# EAGLE design CyDAQ_schematic (EAGLE 9.0.1)
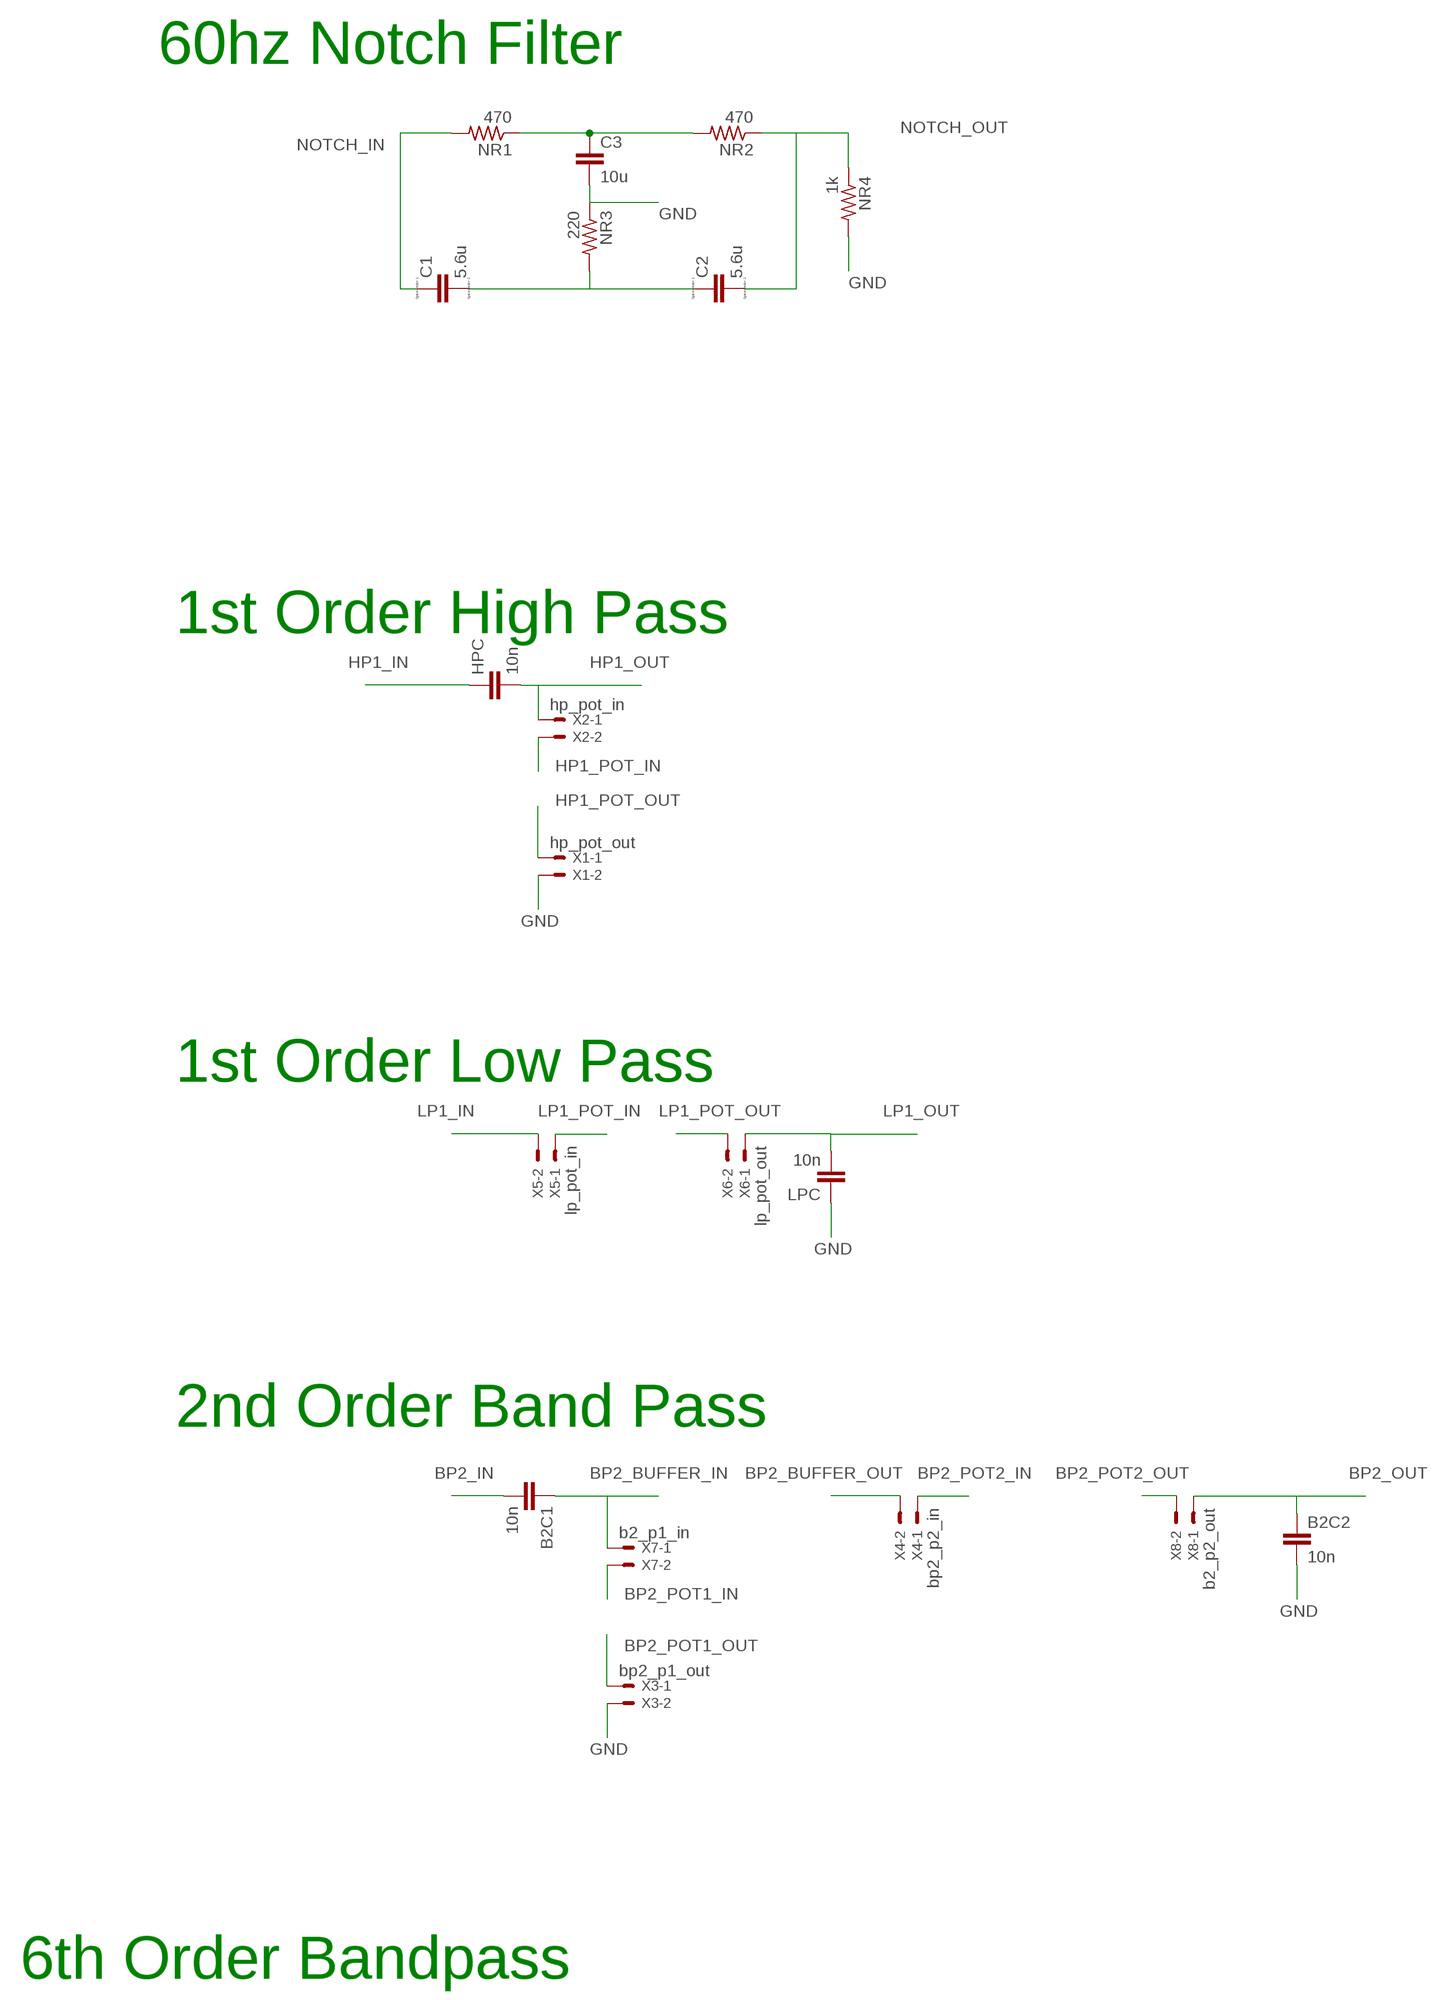
[diagram p0: schematic, sheet 1, part 1 of 3]
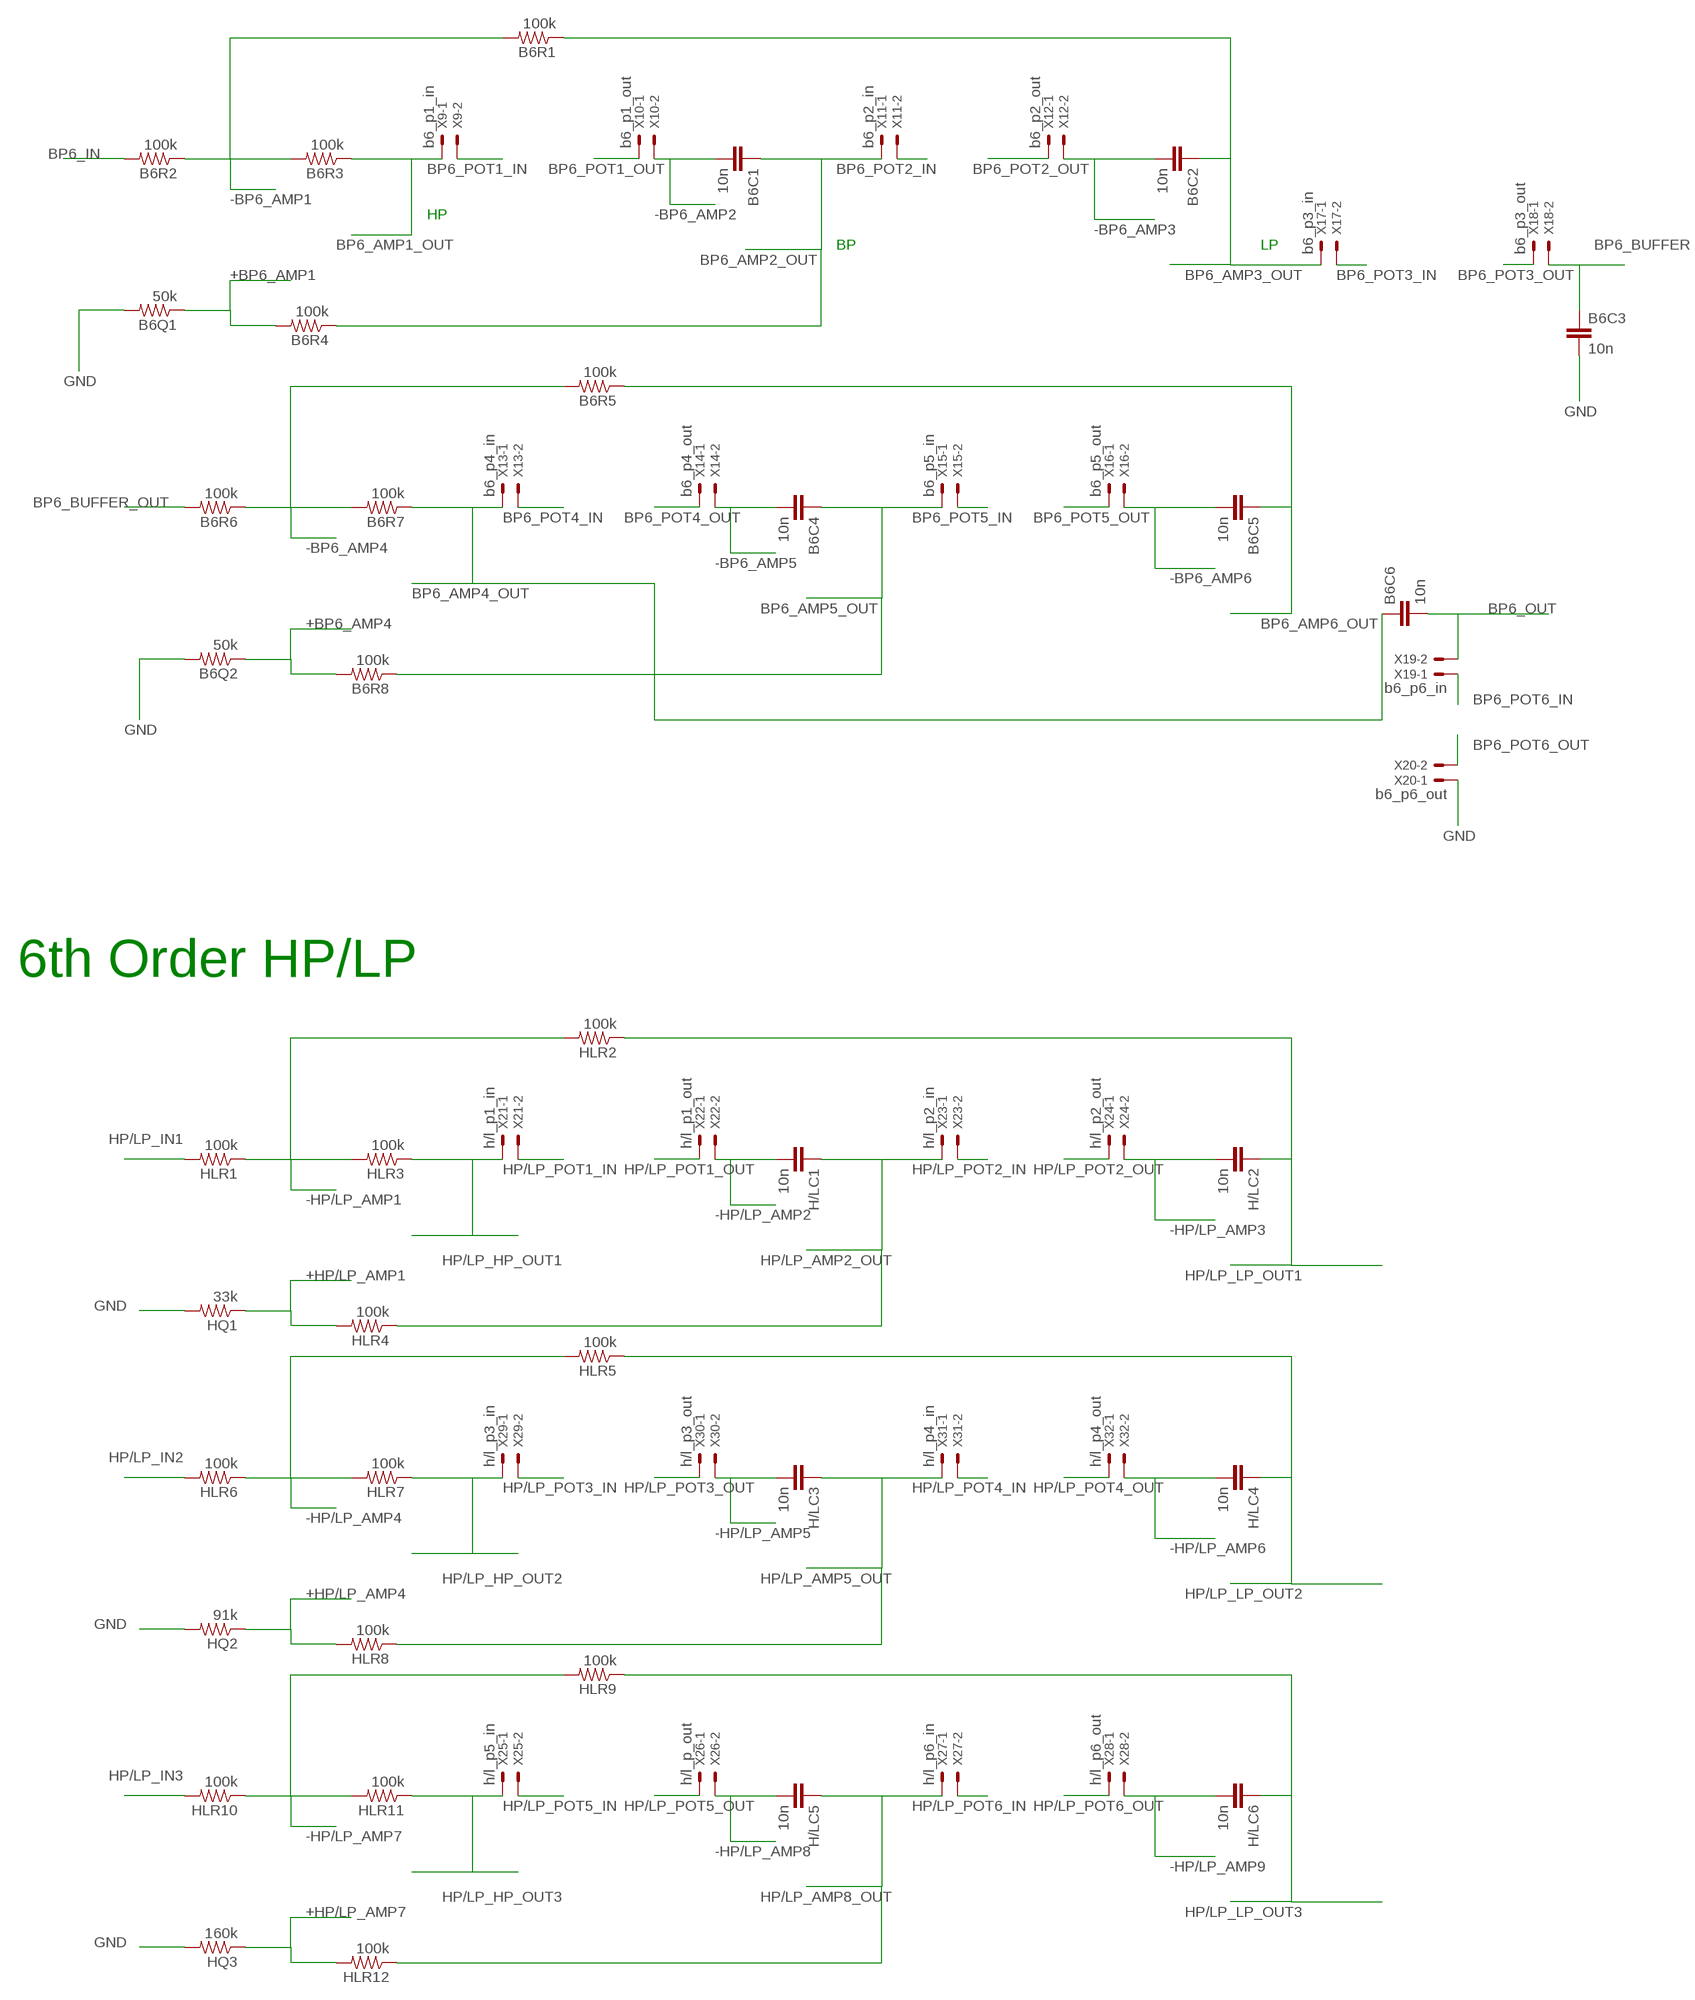
[diagram p1: schematic, sheet 1, part 2 of 3]
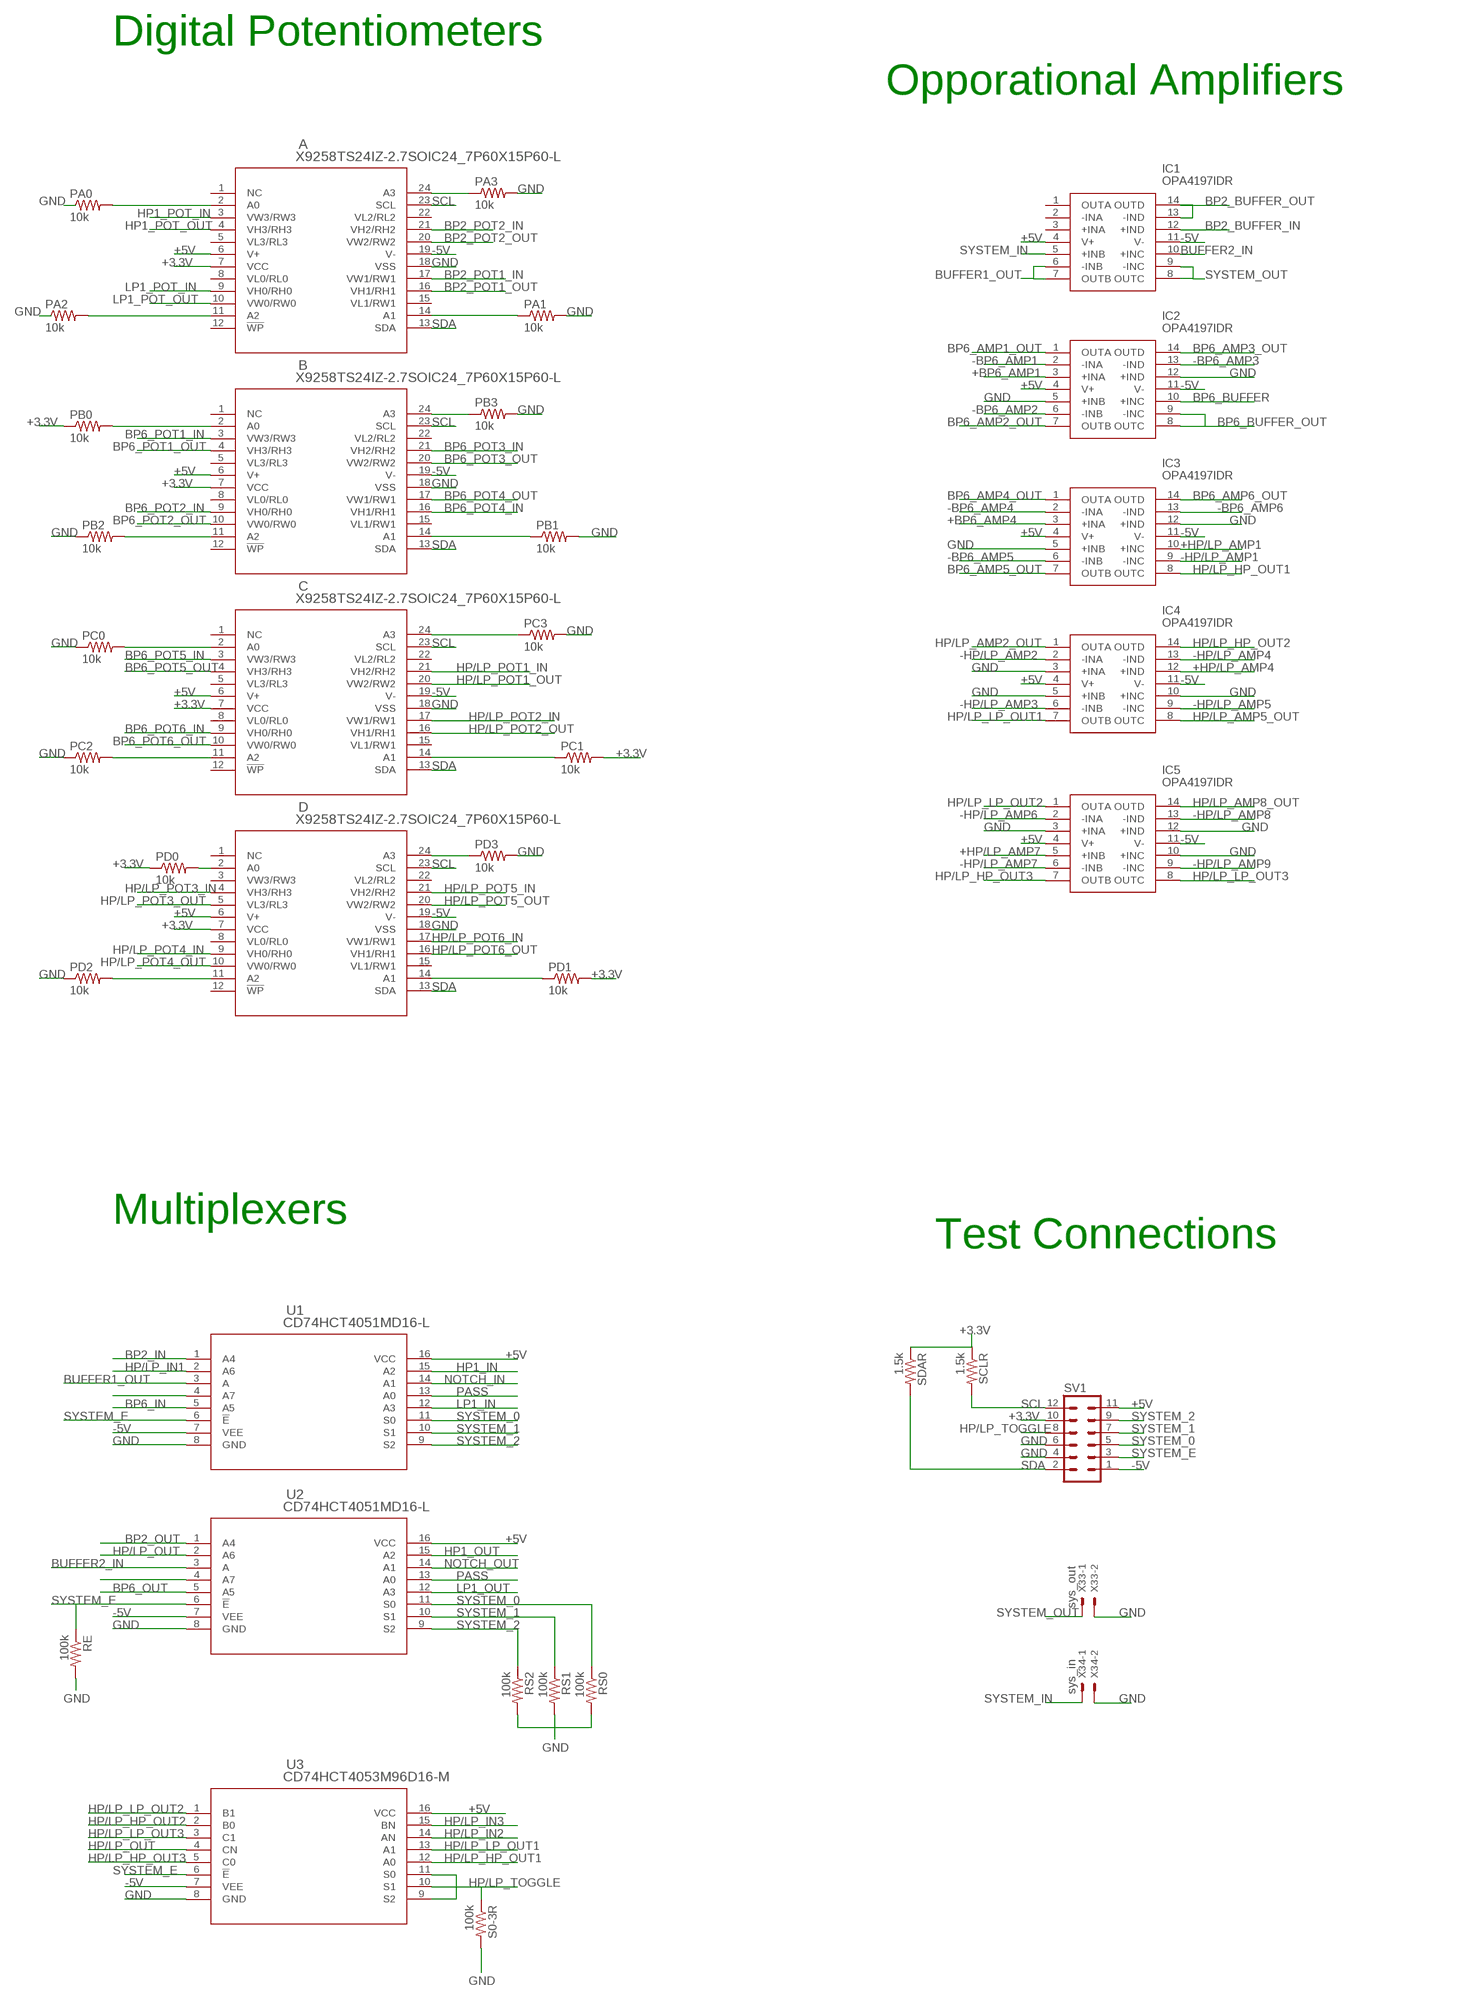
[diagram p2: schematic, sheet 1, part 3 of 3]

## Parts
A  X9258TS24IZ-2.7SOIC24_7P60X15P60-L  [SOIC24_7P60X15P60-L]
B  X9258TS24IZ-2.7SOIC24_7P60X15P60-L  [SOIC24_7P60X15P60-L]
B2C1  10n  C-EUC0805K  [C0805K]
B2C2  10n  C-EUC0805K  [C0805K]
B6C1  10n  C-EUC0805K  [C0805K]
B6C2  10n  C-EUC0805K  [C0805K]
B6C3  10n  C-EUC0805K  [C0805K]
B6C4  10n  C-EUC0805K  [C0805K]
B6C5  10n  C-EUC0805K  [C0805K]
B6C6  10n  C-EUC0805K  [C0805K]
B6Q1  50k  R-US_R0805W  [R0805W]
B6Q2  50k  R-US_R0805W  [R0805W]
B6R1  100k  R-US_R0805W  [R0805W]
B6R2  100k  R-US_R0805W  [R0805W]
B6R3  100k  R-US_R0805W  [R0805W]
B6R4  100k  R-US_R0805W  [R0805W]
B6R5  100k  R-US_R0805W  [R0805W]
B6R6  100k  R-US_R0805W  [R0805W]
B6R7  100k  R-US_R0805W  [R0805W]
B6R8  100k  R-US_R0805W  [R0805W]
C  X9258TS24IZ-2.7SOIC24_7P60X15P60-L  [SOIC24_7P60X15P60-L]
C1  5.6u  CC1206  [C1206]
C2  5.6u  CC1206  [C1206]
C3  10u  C-EUC2012  [C2012]
D  X9258TS24IZ-2.7SOIC24_7P60X15P60-L  [SOIC24_7P60X15P60-L]
H/LC1  10n  C-EUC0805K  [C0805K]
H/LC2  10n  C-EUC0805K  [C0805K]
H/LC3  10n  C-EUC0805K  [C0805K]
H/LC4  10n  C-EUC0805K  [C0805K]
H/LC5  10n  C-EUC0805K  [C0805K]
H/LC6  10n  C-EUC0805K  [C0805K]
HLR1  100k  R-US_R0805W  [R0805W]
HLR2  100k  R-US_R0805W  [R0805W]
HLR3  100k  R-US_R0805W  [R0805W]
HLR4  100k  R-US_R0805W  [R0805W]
HLR5  100k  R-US_R0805W  [R0805W]
HLR6  100k  R-US_R0805W  [R0805W]
HLR7  100k  R-US_R0805W  [R0805W]
HLR8  100k  R-US_R0805W  [R0805W]
HLR9  100k  R-US_R0805W  [R0805W]
HLR10  100k  R-US_R0805W  [R0805W]
HLR11  100k  R-US_R0805W  [R0805W]
HLR12  100k  R-US_R0805W  [R0805W]
HPC  10n  C-EUC0805K  [C0805K]
HQ1  33k  R-US_R0805W  [R0805W]
HQ2  91k  R-US_R0805W  [R0805W]
HQ3  160k  R-US_R0805W  [R0805W]
IC1  OPA4197IDR  [SOIC127P600X175-14N]
IC2  OPA4197IDR  [SOIC127P600X175-14N]
IC3  OPA4197IDR  [SOIC127P600X175-14N]
IC4  OPA4197IDR  [SOIC127P600X175-14N]
IC5  OPA4197IDR  [SOIC127P600X175-14N]
LPC  10n  C-EUC0805K  [C0805K]
NR1  470  R-US_R0805W  [R0805W]
NR2  470  R-US_R0805W  [R0805W]
NR3  220  R-US_R0805W  [R0805W]
NR4  1k  R-US_R0805W  [R0805W]
PA0  10k  R-US_R0805W  [R0805W]
PA1  10k  R-US_R0805W  [R0805W]
PA2  10k  R-US_R0805W  [R0805W]
PA3  10k  R-US_R0805W  [R0805W]
PB0  10k  R-US_R0805W  [R0805W]
PB1  10k  R-US_R0805W  [R0805W]
PB2  10k  R-US_R0805W  [R0805W]
PB3  10k  R-US_R0805W  [R0805W]
PC0  10k  R-US_R0805W  [R0805W]
PC1  10k  R-US_R0805W  [R0805W]
PC2  10k  R-US_R0805W  [R0805W]
PC3  10k  R-US_R0805W  [R0805W]
PD0  10k  R-US_R0805W  [R0805W]
PD1  10k  R-US_R0805W  [R0805W]
PD2  10k  R-US_R0805W  [R0805W]
PD3  10k  R-US_R0805W  [R0805W]
RE  100k  R-US_R0805W  [R0805W]
RS0  100k  R-US_R0805W  [R0805W]
RS1  100k  R-US_R0805W  [R0805W]
RS2  100k  R-US_R0805W  [R0805W]
S0-3R  100k  R-US_R0805W  [R0805W]
SCLR  1.5k  R-US_R0805W  [R0805W]
SDAR  1.5k  R-US_R0805W  [R0805W]
SV1  MA06-2  [MA06-2]
U1  CD74HCT4051MD16-L  [D16-L]
U2  CD74HCT4051MD16-L  [D16-L]
U3  CD74HCT4053M96D16-M  [D16-M]
X1  hp_pot_out  22-23-2021  [22-23-2021]
X2  hp_pot_in  22-23-2021  [22-23-2021]
X3  bp2_p1_out  22-23-2021  [22-23-2021]
X4  bp2_p2_in  22-23-2021  [22-23-2021]
X5  lp_pot_in  22-23-2021  [22-23-2021]
X6  lp_pot_out  22-23-2021  [22-23-2021]
X7  b2_p1_in  22-23-2021  [22-23-2021]
X8  b2_p2_out  22-23-2021  [22-23-2021]
X9  b6_p1_in  22-23-2021  [22-23-2021]
X10  b6_p1_out  22-23-2021  [22-23-2021]
X11  b6_p2_in  22-23-2021  [22-23-2021]
X12  b6_p2_out  22-23-2021  [22-23-2021]
X13  b6_p4_in  22-23-2021  [22-23-2021]
X14  b6_p4_out  22-23-2021  [22-23-2021]
X15  b6_p5_in  22-23-2021  [22-23-2021]
X16  b6_p5_out  22-23-2021  [22-23-2021]
X17  b6_p3_in  22-23-2021  [22-23-2021]
X18  b6_p3_out  22-23-2021  [22-23-2021]
X19  b6_p6_in  22-23-2021  [22-23-2021]
X20  b6_p6_out  22-23-2021  [22-23-2021]
X21  h/l_p1_in  22-23-2021  [22-23-2021]
X22  h/l_p1_out  22-23-2021  [22-23-2021]
X23  h/l_p2_in  22-23-2021  [22-23-2021]
X24  h/l_p2_out  22-23-2021  [22-23-2021]
X25  h/l_p5_in  22-23-2021  [22-23-2021]
X26  h/l_p_out  22-23-2021  [22-23-2021]
X27  h/l_p6_in  22-23-2021  [22-23-2021]
X28  h/l_p6_out  22-23-2021  [22-23-2021]
X29  h/l_p3_in  22-23-2021  [22-23-2021]
X30  h/l_p3_out  22-23-2021  [22-23-2021]
X31  h/l_p4_in  22-23-2021  [22-23-2021]
X32  h/l_p4_out  22-23-2021  [22-23-2021]
X33  sys_out  22-23-2021  [22-23-2021]
X34  sys_in  22-23-2021  [22-23-2021]

## Nets
+3.3V: A.7(VCC) B.7(VCC) C.7(VCC) D.7(VCC) PB0.1 PC1.2 PD0.1 PD1.2 SCLR.1 SDAR.1 SV1.10
+5V: A.6(V+) B.6(V+) C.6(V+) D.6(V+) IC1.4(V+) IC2.4(V+) IC3.4(V+) IC4.4(V+) IC5.4(V+) SV1.11 U1.16(VCC) U2.16(VCC) U3.16(VCC)
+BP6_AMP1: B6Q1.1 B6R4.2 IC2.3(+INA)
+BP6_AMP4: B6Q2.1 B6R8.2 IC3.3(+INA)
+HP/LP_AMP1: HLR4.2 HQ1.1 IC3.10(+INC)
+HP/LP_AMP4: HLR8.2 HQ2.1 IC4.12(+IND)
+HP/LP_AMP7: HLR12.2 HQ3.1 IC5.5(+INB)
-5V: A.19(V-) B.19(V-) C.19(V-) D.19(V-) IC1.11(V-) IC2.11(V-) IC3.11(V-) IC4.11(V-) IC5.11(V-) SV1.1 U1.7(VEE) U2.7(VEE) U3.7(VEE)
-BP6_AMP1: B6R1.2 B6R2.1 B6R3.2 IC2.2(-INA)
-BP6_AMP2: B6C1.2 IC2.6(-INB) X10.2
-BP6_AMP3: B6C2.2 IC2.13(-IND) X12.2
-BP6_AMP4: B6R5.2 B6R6.1 B6R7.2 IC3.2(-INA)
-BP6_AMP5: B6C4.2 IC3.6(-INB) X14.2
-BP6_AMP6: B6C5.2 IC3.13(-IND) X16.2
-HP/LP_AMP1: HLR1.1 HLR2.2 HLR3.2 IC3.9(-INC)
-HP/LP_AMP2: H/LC1.2 IC4.2(-INA) X22.2
-HP/LP_AMP3: H/LC2.2 IC4.6(-INB) X24.2
-HP/LP_AMP4: HLR5.2 HLR6.1 HLR7.2 IC4.13(-IND)
-HP/LP_AMP5: H/LC3.2 IC4.9(-INC) X30.2
-HP/LP_AMP6: H/LC4.2 IC5.2(-INA) X32.2
-HP/LP_AMP7: HLR9.2 HLR10.1 HLR11.2 IC5.6(-INB)
-HP/LP_AMP8: H/LC5.2 IC5.13(-IND) X26.2
-HP/LP_AMP9: H/LC6.2 IC5.9(-INC) X28.2
BP2_BUFFER_IN: B2C1.1 IC1.12(+IND) X7.1
BP2_BUFFER_OUT: IC1.13(-IND) IC1.14(OUTD) X4.2
BP2_IN: B2C1.2 U1.1(A4)
BP2_OUT: B2C2.1 U2.1(A4) X8.1
BP2_POT1_IN: A.17(VW1/RW1) X7.2
BP2_POT1_OUT: A.16(VH1/RH1) X3.1
BP2_POT2_IN: A.21(VH2/RH2) X4.1
BP2_POT2_OUT: A.20(VW2/RW2) X8.2
BP6_AMP1_OUT: B6R3.1 IC2.1(OUTA) X9.1
BP6_AMP2_OUT: B6C1.1 B6R4.1 IC2.7(OUTB) X11.1
BP6_AMP3_OUT: B6C2.1 B6R1.1 IC2.14(OUTD) X17.1
BP6_AMP4_OUT: B6C6.1 B6R7.1 IC3.1(OUTA) X13.1
BP6_AMP5_OUT: B6C4.1 B6R8.1 IC3.7(OUTB) X15.1
BP6_AMP6_OUT: B6C5.1 B6R5.1 IC3.14(OUTD)
BP6_BUFFER: B6C3.1 IC2.10(+INC) X18.2
BP6_BUFFER_OUT: B6R6.2 IC2.8(OUTC) IC2.9(-INC)
BP6_IN: B6R2.2 U1.5(A5)
BP6_OUT: B6C6.2 U2.5(A5) X19.2
BP6_POT1_IN: B.3(VW3/RW3) X9.2
BP6_POT1_OUT: B.4(VH3/RH3) X10.1
BP6_POT2_IN: B.9(VH0/RH0) X11.2
BP6_POT2_OUT: B.10(VW0/RW0) X12.1
BP6_POT3_IN: B.21(VH2/RH2) X17.2
BP6_POT3_OUT: B.20(VW2/RW2) X18.1
BP6_POT4_IN: B.16(VH1/RH1) X13.2
BP6_POT4_OUT: B.17(VW1/RW1) X14.1
BP6_POT5_IN: C.3(VW3/RW3) X15.2
BP6_POT5_OUT: C.4(VH3/RH3) X16.1
BP6_POT6_IN: C.9(VH0/RH0) X19.1
BP6_POT6_OUT: C.10(VW0/RW0) X20.2
BUFFER1_OUT: IC1.6(-INB) IC1.7(OUTB) U1.3(A)
BUFFER2_IN: IC1.10(+INC) U2.3(A)
GND: A.18(VSS) B2C2.2 B6C3.2 B6Q1.2 B6Q2.2 B.18(VSS) C3.2 C.18(VSS) D.18(VSS) HQ1.2 HQ2.2 HQ3.2 IC2.5(+INB) IC2.12(+IND) IC3.5(+INB) IC3.12(+IND) IC4.3(+INA) IC4.5(+INB) IC4.10(+INC) IC5.3(+INA) IC5.10(+INC) IC5.12(+IND) LPC.1 NR3.1 NR4.2 PA0.1 PA1.2 PA2.1 PA3.2 PB1.2 PB2.1 PB3.2 PC0.1 PC2.1 PC3.2 PD2.1 PD3.2 RE.2 RS0.2 RS1.2 RS2.2 S0-3R.2 SV1.4 SV1.6 U1.8(GND) U2.8(GND) U3.8(GND) X1.2 X3.2 X20.1 X33.2 X34.2
HP1_IN: HPC.1 U1.15(A2)
HP1_OUT: HPC.2 U2.15(A2) X2.1
HP1_POT_IN: A.3(VW3/RW3) X2.2
HP1_POT_OUT: A.4(VH3/RH3) X1.1
HP/LP_AMP2_OUT: H/LC1.1 HLR4.1 IC4.1(OUTA) X23.1
HP/LP_AMP5_OUT: H/LC3.1 HLR8.1 IC4.8(OUTC) X31.1
HP/LP_AMP8_OUT: H/LC5.1 HLR12.1 IC5.14(OUTD) X27.1
HP/LP_HP_OUT1: HLR3.1 IC3.8(OUTC) U3.12(A0) X21.1
HP/LP_HP_OUT2: HLR7.1 IC4.14(OUTD) U3.2(B0) X29.1
HP/LP_HP_OUT3: HLR11.1 IC5.7(OUTB) U3.5(C0) X25.1
HP/LP_IN1: HLR1.2 U1.2(A6)
HP/LP_IN2: HLR6.2 U3.14(AN)
HP/LP_IN3: HLR10.2 U3.15(BN)
HP/LP_LP_OUT1: H/LC2.1 HLR2.1 IC4.7(OUTB) U3.13(A1)
HP/LP_LP_OUT2: H/LC4.1 HLR5.1 IC5.1(OUTA) U3.1(B1)
HP/LP_LP_OUT3: H/LC6.1 HLR9.1 IC5.8(OUTC) U3.3(C1)
HP/LP_OUT: U2.2(A6) U3.4(CN)
HP/LP_POT1_IN: C.21(VH2/RH2) X21.2
HP/LP_POT1_OUT: C.20(VW2/RW2) X22.1
HP/LP_POT2_IN: C.17(VW1/RW1) X23.2
HP/LP_POT2_OUT: C.16(VH1/RH1) X24.1
HP/LP_POT3_IN: D.4(VH3/RH3) X29.2
HP/LP_POT3_OUT: D.5(VL3/RL3) X30.1
HP/LP_POT4_IN: D.9(VH0/RH0) X31.2
HP/LP_POT4_OUT: D.10(VW0/RW0) X32.1
HP/LP_POT5_IN: D.21(VH2/RH2) X25.2
HP/LP_POT5_OUT: D.20(VW2/RW2) X26.1
HP/LP_POT6_IN: D.17(VW1/RW1) X27.2
HP/LP_POT6_OUT: D.16(VH1/RH1) X28.1
HP/LP_TOGGLE: S0-3R.1 SV1.8 U3.9(S2) U3.10(S1) U3.11(S0)
LP1_IN: U1.12(A3) X5.2
LP1_OUT: LPC.2 U2.12(A3) X6.1
LP1_POT_IN: A.9(VH0/RH0) X5.1
LP1_POT_OUT: A.10(VW0/RW0) X6.2
N$1: A.2(A0) PA0.2
N$2: A.11(A2) PA2.2
N$3: A.14(A1) PA1.1
N$4: A.24(A3) PA3.1
N$5: B.2(A0) PB0.2
N$6: B.11(A2) PB2.2
N$7: B.14(A1) PB1.1
N$8: B.24(A3) PB3.1
N$9: C1.2 C2.1 NR3.2
N$10: C.2(A0) PC0.2
N$11: C.11(A2) PC2.2
N$12: C.14(A1) PC1.1
N$13: C.24(A3) PC3.1
N$14: D.2(A0) PD0.2
N$15: D.11(A2) PD2.2
N$16: D.14(A1) PD1.1
N$17: D.24(A3) PD3.1
N$19: C3.1 NR1.1 NR2.2
N$26: U2.4(A7)
N$36: U1.4(A7)
NOTCH_IN: C1.1 NR1.2 U1.14(A1)
NOTCH_OUT: C2.2 NR2.1 NR4.1 U2.14(A1)
PASS: U1.13(A0) U2.13(A0)
SCL: A.23(SCL) B.23(SCL) C.23(SCL) D.23(SCL) SCLR.2 SV1.12
SDA: A.13(SDA) B.13(SDA) C.13(SDA) D.13(SDA) SDAR.2 SV1.2
SYSTEM_0: RS0.1 SV1.5 U1.11(S0) U2.11(S0)
SYSTEM_1: RS1.1 SV1.7 U1.10(S1) U2.10(S1)
SYSTEM_2: RS2.1 SV1.9 U1.9(S2) U2.9(S2)
SYSTEM_E: RE.1 SV1.3 U1.6(!E) U2.6(!E) U3.6(!E)
SYSTEM_IN: IC1.5(+INB) X34.1
SYSTEM_OUT: IC1.8(OUTC) IC1.9(-INC) X33.1
Unconnected: A.1(NC) A.5(VL3/RL3) A.8(VL0/RL0) A.12(!WP) A.15(VL1/RW1) A.22(VL2/RL2) B.1(NC) B.5(VL3/RL3) B.8(VL0/RL0) B.12(!WP) B.15(VL1/RW1) B.22(VL2/RL2) C.1(NC) C.5(VL3/RL3) C.8(VL0/RL0) C.12(!WP) C.15(VL1/RW1) C.22(VL2/RL2) D.1(NC) D.3(VW3/RW3) D.8(VL0/RL0) D.12(!WP) D.15(VL1/RW1) D.22(VL2/RL2) IC1.1(OUTA) IC1.2(-INA) IC1.3(+INA)

## Notes on the sheet
- 60hz Notch Filter
- 1st Order High Pass
- Digital Potentiometers
- Opporational Amplifiers
- 1st Order Low Pass
- 2nd Order Band Pass
- 6th Order Bandpass
- HP
- BP | LP
- Multiplexers
- Test Connections
- 6th Order HP/LP

## Library data of the parts
A B C D = potWithPosNeg5:X9258TS24IZ-2.7; MANUFACTURER_PART_NUMBER: X9258TS24IZ2.7; VENDOR: Intersil
B2C1 B2C2 B6C1-B6C6 C3 H/LC1-H/LC6 HPC LPC = resistor:C-EU: CAPACITOR, European symbol
B6Q1 B6Q2 B6R1-B6R8 HLR1-HLR12 HQ1-HQ3 NR1-NR4 PA0 PA1-PA3 PB0 PB1-PB3 PC0 PC1-PC3 PD0 PD1-PD3 RE RS0 RS1 RS2 S0-3R SCLR SDAR = resistor:R-US_: RESISTOR, American symbol
C1 C2 = eagle-ltspice:C: CAPACITOR, European symbol; SPICEMODEL: NONE; SPICEPREFIX: C
IC1-IC5 = opAmp:OPA4197IDR: 36-V, Precision, Rail-to-Rail Input Output, Low Offset Voltage Op Amp Source: Datasheet <http://www.ti.com/lit/gpn/opa4197>; DESCRIPTION: 36-V, Precision, Rail-to-Rail Input Output, Low Offset Voltage Op Amp; HEIGHT: 1.75mm; MANUFACTURER_NAME: Texas Instruments; MANUFACTURER_PART_NUMBER: OPA4197IDR; MOUSER_PART_NUMBER: 595-OPA4197IDR
SV1 = con-lstb:MA06-2: PIN HEADER; OC_FARNELL: unknown; OC_NEWARK: unknown
U1 U2 = 8 to one mux:CD74HCT4051M; MANUFACTURER_PART_NUMBER: CD74HCT4051M; VENDOR: Texas Instruments
U3 = 3, 2 to 1 muxes:CD74HCT4053M96; MANUFACTURER_PART_NUMBER: CD74HCT4053M96; VENDOR: Texas Instruments
X1-X34 = con-molex:22-23-2021: .100" (2.54mm) Center Header - 2 Pin; MF: MOLEX; MPN: 22-23-2021; OC_FARNELL: 1462926; OC_NEWARK: 25C3832

## Board
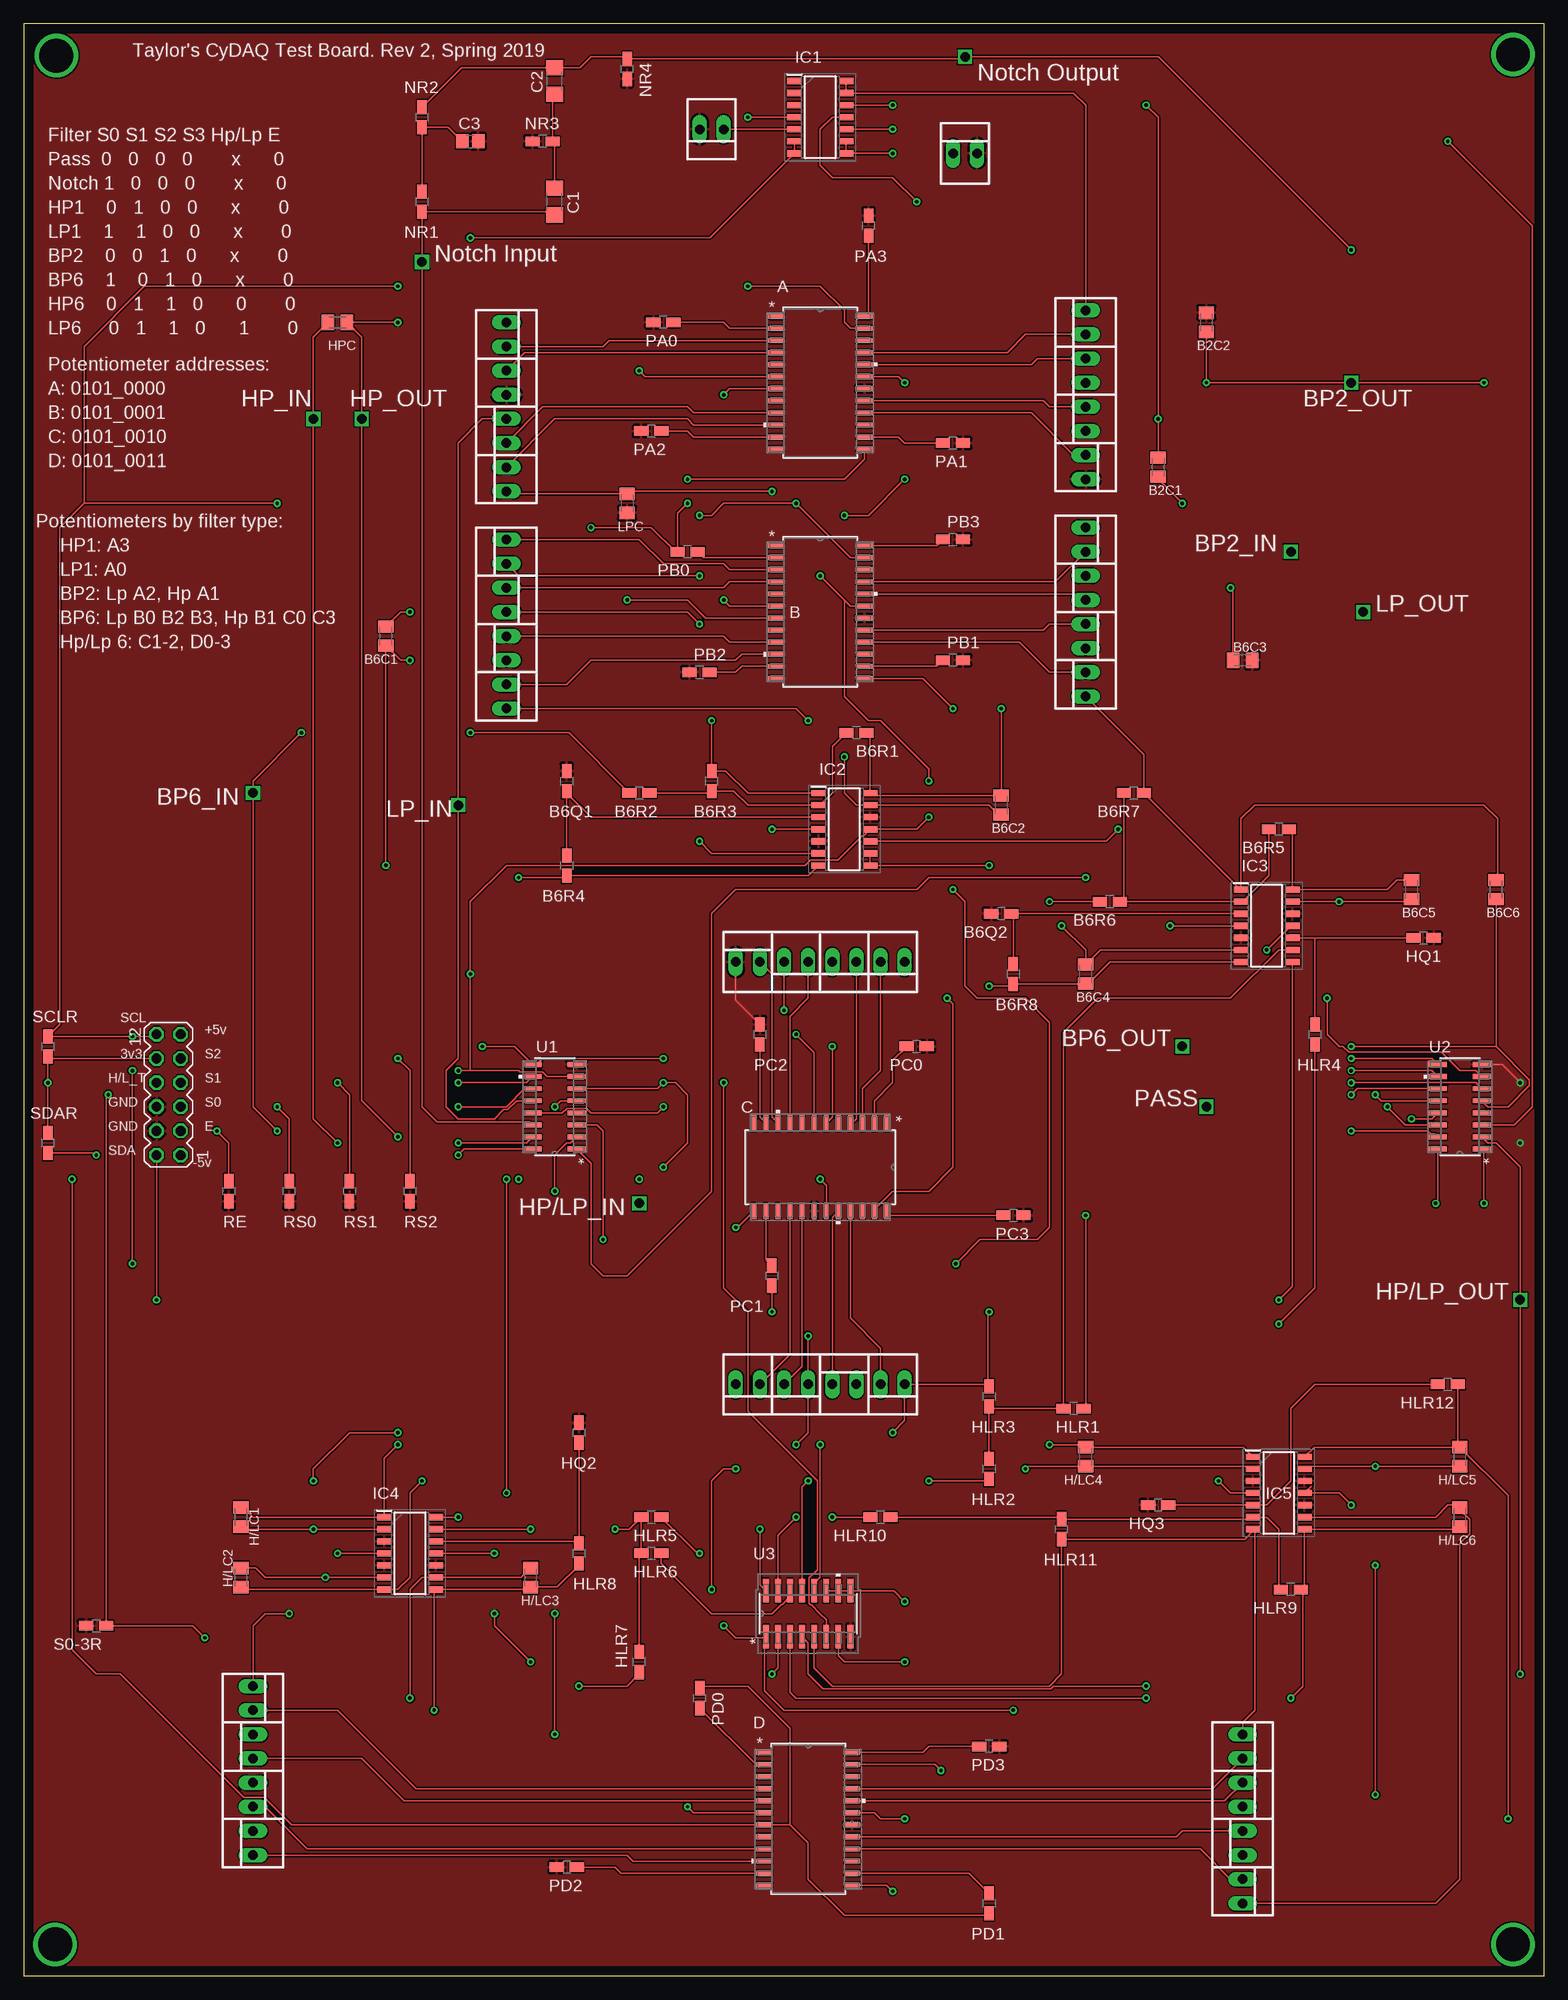
[diagram p3: board, top side]
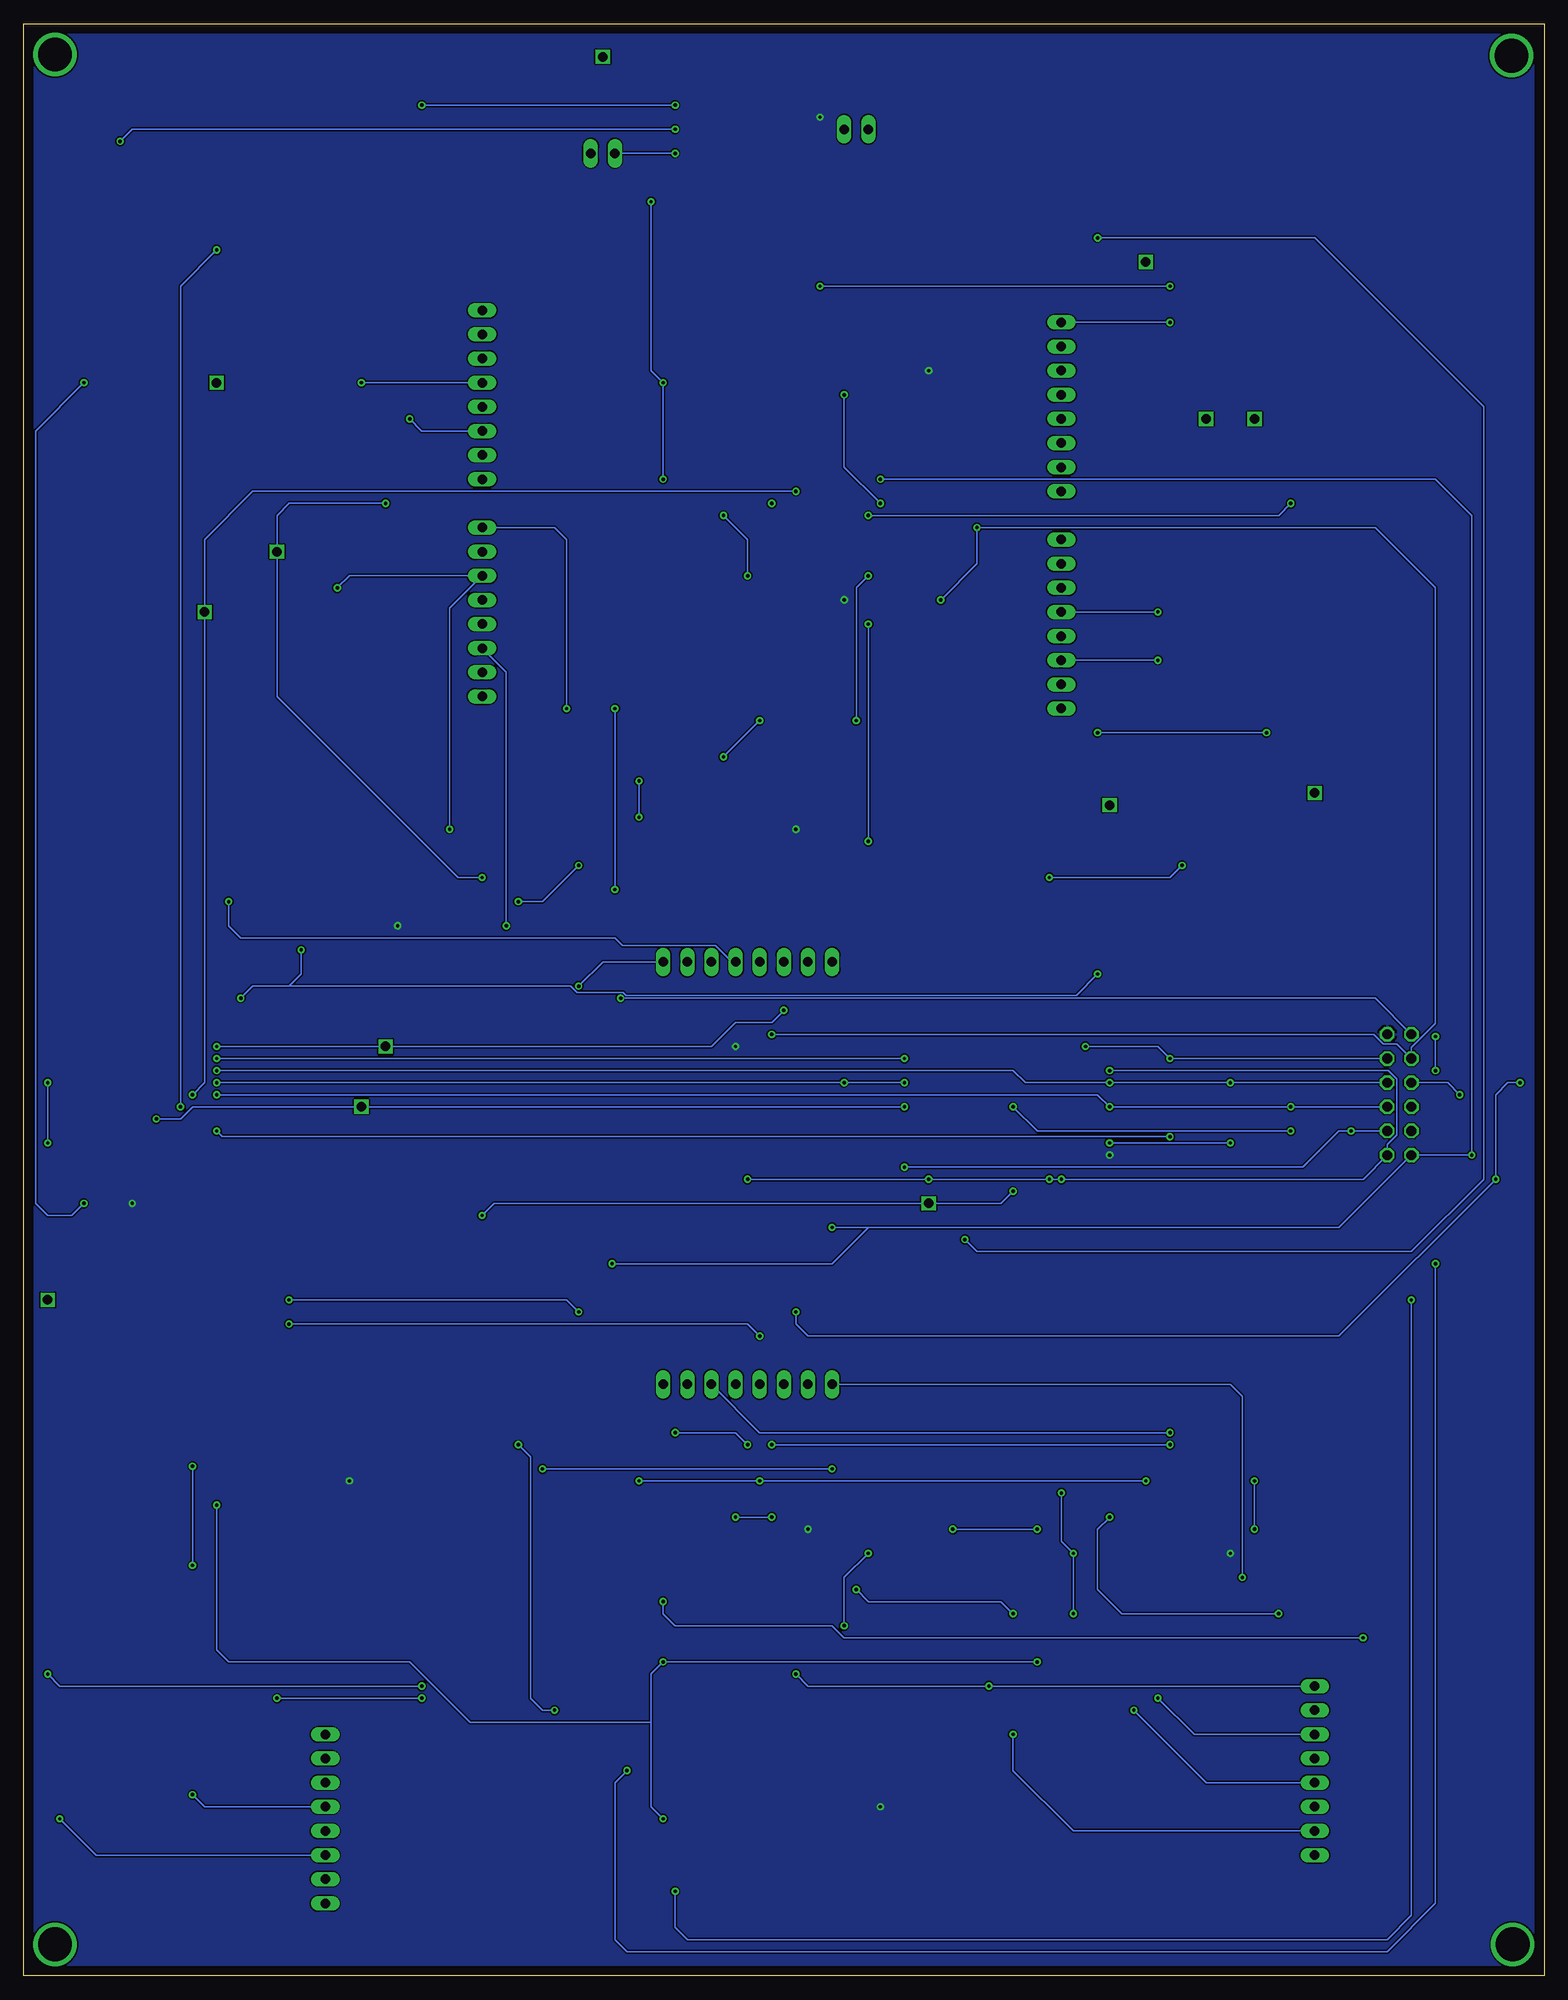
[diagram p4: board, bottom side, seen from below]

Size 160 x 205.41 mm. Coordinates in mm from the lower left corner, seen from the top.
Outline: 0,0 160,0 160,205.41 0,205.41 0,0
Copper layers (1*16): Top 0.035mm / dielectric 1.5mm / Bottom 0.035mm
Design rules "default": minimum track width 6mil, minimum drill 0.35mm, track to track 6mil, track to pad 6mil, pad to pad 6mil, via to via 6mil, smd to smd 6mil, copper to edge 40mil, drill to drill 6mil, minimum pad ring 10mil, minimum via ring 8mil, stop-mask expansion 4mil, vias tented up to drill 0mil, thermal gap 10mil

### Footprints (pad centres in the part's own frame; a part is rotated, then mirrored left to right if it is on the bottom)
SOIC24_7P60X15P60-L = smd 1.676 x 0.508: 1 -4.636,6.985; 2 -4.636,5.715; 3 -4.636,4.445; 4 -4.636,3.175; 5 -4.636,1.905; 6 -4.636,0.635; 7 -4.636,-0.635; 8 -4.636,-1.905; 9 -4.636,-3.175; 10 -4.636,-4.445; 11 -4.636,-5.715; 12 -4.636,-6.985; 13 4.636,-6.985; 14 4.636,-5.715; 15 4.636,-4.445; 16 4.636,-3.175; 17 4.636,-1.905; 18 4.636,-0.635; 19 4.636,0.635; 20 4.636,1.905; 21 4.636,3.175; 22 4.636,4.445; 23 4.636,5.715; 24 4.636,6.985
C0805K = smd 1.3 x 1.6: 1 -1,0; 2 1,0
R0805W = smd 1.5 x 1: 1 -1.052,0; 2 1.052,0
C1206 = smd 1.6 x 1.8: 1 -1.4,0; 2 1.4,0
C2012 = smd 1.3 x 1.5: 1 -0.85,0; 2 0.85,0
SOIC127P600X175-14N = smd 1.525 x 0.65: 1 -2.712,3.81; 2 -2.712,2.54; 3 -2.712,1.27; 4 -2.712,0; 5 -2.712,-1.27; 6 -2.712,-2.54; 7 -2.712,-3.81; 8 2.712,-3.81; 9 2.712,-2.54; 10 2.712,-1.27; 11 2.712,0; 12 2.712,1.27; 13 2.712,2.54; 14 2.712,3.81
MA06-2 = drill 1.016 octagon: 1 -6.35,-1.27; 2 -6.35,1.27; 3 -3.81,-1.27; 4 -3.81,1.27; 5 -1.27,-1.27; 6 -1.27,1.27; 7 1.27,-1.27; 8 1.27,1.27; 9 3.81,-1.27; 10 3.81,1.27; 11 6.35,-1.27; 12 6.35,1.27
D16-L = smd 1.88 x 0.508: 1 -2.311,4.445; 2 -2.311,3.175; 3 -2.311,1.905; 4 -2.311,0.635; 5 -2.311,-0.635; 6 -2.311,-1.905; 7 -2.311,-3.175; 8 -2.311,-4.445; 9 2.311,-4.445; 10 2.311,-3.175; 11 2.311,-1.905; 12 2.311,-0.635; 13 2.311,0.635; 14 2.311,1.905; 15 2.311,3.175; 16 2.311,4.445
D16-M = smd 2.489 x 0.61: 1 -2.413,4.445; 2 -2.413,3.175; 3 -2.413,1.905; 4 -2.413,0.635; 5 -2.413,-0.635; 6 -2.413,-1.905; 7 -2.413,-3.175; 8 -2.413,-4.445; 9 2.413,-4.445; 10 2.413,-3.175; 11 2.413,-1.905; 12 2.413,-0.635; 13 2.413,0.635; 14 2.413,1.905; 15 2.413,3.175; 16 2.413,4.445
22-23-2021 = drill 1 long: 1 -1.27,0; 2 1.27,0

### Placement (x,y rotation side)
A  83.82,167.64 0 top
B  83.82,143.51 0 top
B2C1  119.38,158.75 270 top
B2C2  124.46,173.99 90 top
B6C1  38.1,140.97 90 top
B6C2  102.87,123.19 270 top
B6C3  128.27,138.43 0 top
B6C4  111.76,105.41 90 top
B6C5  146.05,114.3 270 top
B6C6  154.94,114.3 270 top
B6Q1  57.15,125.73 90 top
B6Q2  102.87,111.76 180 top
B6R1  87.63,130.81 180 top
B6R2  64.77,124.46 180 top
B6R3  72.39,125.73 270 top
B6R4  57.15,116.84 90 top
B6R5  132.08,120.65 180 top
B6R6  114.3,113.03 180 top
B6R7  116.84,124.46 180 top
B6R8  104.14,105.41 90 top
C  83.82,85.09 270 top
C1  55.88,186.69 90 top
C2  55.88,199.39 90 top
C3  46.99,193.04 0 top
D  82.55,16.51 0 top
H/LC1  22.86,48.26 270 top
H/LC2  22.86,41.91 90 top
H/LC3  53.34,41.91 90 top
H/LC4  111.76,54.61 270 top
H/LC5  151.13,54.61 270 top
H/LC6  151.13,48.26 90 top
HLR1  110.49,59.69 0 top
HLR2  101.6,53.34 90 top
HLR3  101.6,60.96 270 top
HLR4  135.89,99.06 90 top
HLR5  66.04,48.26 180 top
HLR6  66.04,44.45 0 top
HLR7  64.77,33.02 90 top
HLR8  58.42,44.45 90 top
HLR9  133.35,40.64 180 top
HLR10  90.17,48.26 180 top
HLR11  109.22,46.99 90 top
HLR12  149.86,62.23 180 top
HPC  33.02,173.99 0 top
HQ1  147.32,109.22 0 top
HQ2  58.42,57.15 90 top
HQ3  119.38,49.53 180 top
IC1  83.82,195.58 0 top
IC2  86.36,120.65 0 top
IC3  130.81,110.49 0 top
IC4  40.64,44.45 0 top
IC5  132.08,50.8 0 top
LPC  63.5,154.94 90 top
NR1  41.91,186.69 270 top
NR2  41.91,195.58 270 top
NR3  54.61,193.04 0 top
NR4  63.5,200.66 270 top
PA0  67.31,173.99 0 top
PA1  97.79,161.29 0 top
PA2  66.04,162.56 0 top
PA3  88.9,184.15 90 top
PB0  69.85,149.86 0 top
PB1  97.79,138.43 0 top
PB2  71.12,137.16 0 top
PB3  97.79,151.13 0 top
PC0  93.98,97.79 180 top
PC1  78.74,73.66 270 top
PC2  77.47,99.06 270 top
PC3  104.14,80.01 0 top
PD0  71.12,29.21 270 top
PD1  101.6,7.62 270 top
PD2  57.15,11.43 0 top
PD3  101.6,24.13 0 top
RE  21.59,82.55 270 top
RS0  27.94,82.55 270 top
RS1  34.29,82.55 270 top
RS2  40.64,82.55 270 top
S0-3R  7.62,36.83 180 top
SCLR  2.54,97.79 90 top
SDAR  2.54,87.63 270 top
SV1  15.24,92.71 90 top
U1  55.88,91.44 180 top
U2  151.13,91.44 180 top
U3  82.55,38.1 90 top
X1  50.8,167.64 270 top
X2  50.8,172.72 270 top
X3  111.76,158.75 270 top
X4  111.76,173.99 90 top
X5  50.8,162.56 90 top
X6  50.8,157.48 90 top
X7  111.76,163.83 90 top
X8  111.76,168.91 90 top
X9  50.8,149.86 90 top
X10  50.8,144.78 270 top
X11  50.8,139.7 90 top
X12  50.8,134.62 270 top
X13  111.76,135.89 90 top
X14  111.76,140.97 270 top
X15  91.44,106.68 180 top
X16  86.36,106.68 180 top
X17  111.76,151.13 270 top
X18  111.76,146.05 90 top
X19  81.28,106.68 180 top
X20  76.2,106.68 0 top
X21  91.44,62.23 180 top
X22  86.36,62.23 0 top
X23  81.28,62.23 180 top
X24  76.2,62.23 180 top
X25  128.27,24.13 270 top
X26  128.27,19.05 270 top
X27  128.27,13.97 90 top
X28  128.27,8.89 270 top
X29  24.13,29.21 270 top
X30  24.13,24.13 90 top
X31  24.13,19.05 270 top
X32  24.13,13.97 90 top
X33  99.06,191.77 0 top
X34  72.39,194.31 180 top

### Tracks (layer width: path | path; a pad name or v marks a point on that pad's centre or on a via)
+3.3V  (via drill 0.35)
  Top 0.152: SDAR.1 v2.54,93.98 SCLR.1 2.76,96.52 SV1.10 | C.7 83.19,97.16 v81.28,99.06 | PB0.1 68.58,149.86 66.04,152.4 v59.69,152.4 | PB0.1 68.8,150.08 | 80.64,15.88 D.7 28.18,15.88 25.29,18.76 23.15,18.76 10.16,31.75 7.62,31.75 5.08,34.29 v5.08,83.82 | 80.64,15.88 82.55,13.97 82.55,10.16 86.36,6.35 101.38,6.35 PD1.2 | PB0.1 68.8,153.89 v69.85,154.94 | 79.18,167.2 A.7 74.3,167 v73.66,166.37 | 80.64,15.88 80.64,26.04 76.2,30.48 71.34,30.48 PD0.1 | B.7 71.75,142.88 69.85,144.78 v63.5,144.78 | PC1.2 v78.74,69.85
  Bottom 0.152: v69.85,154.94 73.66,158.75 v73.66,166.37 | v81.28,99.06 17.91,99.06 16.92,98.07 15.52,98.07 SV1.10 13.97,97.66 11.43,100.2 11.43,146.05 17.78,152.4 v59.69,152.4 59.69,148.59 v63.5,144.78 | v78.74,69.85 78.74,68.58 77.47,67.31 21.59,67.31 v5.08,83.82 5.08,92.71 3.81,93.98 v2.54,93.98
+5V  (via drill 0.35)
  Top 0.152: IC1.4 v76.2,195.58 | 78.11,41.27 U3.16 77.47,41.15 v77.47,46.99 | A.6 65.41,168.28 v64.77,168.91 | 148.59,86.77 U2.16 148.82,81.51 v148.59,81.28 | C.6 85.09,90.36 v85.09,97.79 | v125.73,52.07 127,50.8 IC5.4 | v45.72,86.36 46.35,87 U1.16 | IC4.4 v33.02,44.45 | IC2.4 v78.74,120.65 | 79.18,144.34 B.6 74.3,144.15 v73.66,144.78 | D.6 70.48,17.14 v69.85,17.78 | v120.65,110.49 IC3.4
  pour Bottom: 0,205.74 160.02,205.74 160.02,0 0,0
+BP6_AMP1
  Top 0.152: B6Q1.1 57.15,124.46 | 57.15,124.46 B6R4.2 | IC2.3 59.69,121.92 57.15,124.46
+BP6_AMP4
  Top 0.152: 103.92,106.68 B6R8.2 104.14,111.76 | B6Q2.1 104.14,111.76 | 104.14,111.76 IC3.3
+HP/LP_AMP1
  Top 0.152: HQ1.1 135.89,109.22 | 135.89,109.22 IC3.10 | HLR4.2 135.89,109.22
+HP/LP_AMP4
  Top 0.152: HQ2.1 58.42,45.72 | 58.42,45.72 HLR8.2 | IC4.12 58.42,45.72
+HP/LP_AMP7
  Top 0.152: HLR12.2 135.89,62.23 133.35,59.69 133.35,52.07 130.81,49.53 129.54,49.53 IC5.5 HQ3.1
-5V  (via drill 0.35)
  Top 0.152: 153.03,94.61 U2.7 152.81,95.25 151.13,95.25 149.2,97.18 139.45,97.18 138.84,97.79 138.43,97.79 137.16,99.06 v137.16,102.87 | 135.51,51.52 IC5.11 138.43,50.8 v139.7,49.53 | 88.46,143.95 B.19 87,144.15 86.36,144.78 | IC2.11 88.9,120.65 88.9,120.68 | C.19 84.45,83.19 v83.82,83.82 | v93.98,186.69 91.44,189.23 85.09,189.23 83.82,190.5 83.82,194.31 85.09,195.58 IC1.11 | U1.7 55.09,94.61 54.6,95.1 52.22,95.1 52.07,95.25 46.99,95.25 | 46.99,95.25 v45.72,95.25 | v92.71,33.02 86.36,33.02 85.72,33.66 U3.7 | IC4.11 v49.53,44.45 | v50.8,50.8 v50.8,83.82 | v53.34,33.02 49.53,36.83 v49.53,38.1 | IC2.11 88.36,119.93 88.22,119.93 85.67,117.39 82.79,117.39 82.24,116.84 50.8,116.84 46.99,113.03 v46.99,105.41 46.99,95.25 | v95.25,125.73 95.25,127 90.17,132.08 88.9,132.08 86.36,134.62 86.36,144.78 | v95.25,121.92 93.98,120.65 IC2.11 | IC3.11 133.35,110.49 v130.81,107.95 | v92.71,157.48 88.9,153.67 v86.36,153.67 | v83.82,147.32 86.36,144.78 | A.19 92.08,168.28 v92.71,167.64 | D.19 89.53,17.14 90.17,16.51 v92.71,16.51
  Bottom 0.152: v83.82,83.82 v64.77,83.82 v52.07,83.82 v50.8,83.82 19.05,83.82 SV1.1 16.51,87.5 15.52,88.49 15.52,94.39 16.38,95.25 v45.72,95.25 | v93.98,186.69 93.98,168.91 v92.71,167.64 v92.71,157.48 | v92.71,16.51 93.98,17.78 93.98,26.67 | 93.98,26.67 93.98,31.75 v92.71,33.02 v53.34,33.02 | 93.98,26.67 113.03,26.67 119.38,33.02 138.43,33.02 139.7,34.29 v139.7,49.53 | v50.8,50.8 50.8,45.72 v49.53,44.45 v49.53,38.1 | v95.25,125.73 v95.25,121.92 | v130.81,107.95 130.81,105.41 132.08,104.14 | 132.08,104.14 135.89,104.14 v137.16,102.87 | 132.08,104.14 102.46,104.14 101.8,103.48 96.93,103.48 96.63,103.17 49.23,103.17 v46.99,105.41 | v86.36,153.67 83.82,151.13 v83.82,147.32
-BP6_AMP1
  Top 0.152: B6R2.1 72.17,124.46 B6R3.2 74.71,124.68 76.2,123.19 IC2.2 83.82,123.19 85.09,124.46 85.09,129.32 B6R1.2
-BP6_AMP2  (via drill 0.35)
  Top 0.152: B6C1.2 39.64,143.51 v40.64,143.51 | IC2.6 72.39,118.11 v71.12,119.38 | v71.12,142.24 69.85,143.51 X10.2
  Bottom 0.152: v40.64,143.51 X10.2 | v71.12,119.38 v71.12,142.24
-BP6_AMP3  (via drill 0.35)
  Top 0.152: 102.6,121.92 B6C2.2 102.6,122.19 101.6,123.19 IC2.13 87.63,123.19 86.36,124.46 v86.36,128.27 | X12.2 81.28,133.35 v82.55,132.08
  Bottom 0.152: v82.55,132.08 v86.36,128.27
-BP6_AMP4
  Top 0.152: 115.57,124.24 B6R7.2 115.79,113.47 B6R6.1 IC3.2 128.27,113.03 131.03,115.79 B6R5.2
-BP6_AMP5  (via drill 0.35)
  Top 0.152: B6C4.2 111.76,106.68 | B6C4.2 113.3,107.95 IC3.6 | B6C4.2 111.76,107.95 v109.22,110.49
  Bottom 0.152: v109.22,110.49 109.22,137.16 X14.2
-BP6_AMP6  (via drill 0.35)
  Top 0.152: B6C5.2 145.78,113.03 v138.43,113.03 IC3.13
  Bottom 0.152: X16.2 85.49,106.68 87.22,108.42 96.99,108.42 97.79,109.22 137.16,109.22 138.43,110.49 v138.43,113.03
-HP/LP_AMP1
  Top 0.152: 101.6,59.69 HLR3.2 101.82,59.69 | 101.6,59.69 HLR2.2 | IC3.9 132.08,107.95 127,102.87 113.03,102.87 109.44,99.28 HLR1.1 101.6,59.69
-HP/LP_AMP2  (via drill 0.35)
  Top 0.152: 38.1,46.99 IC4.2 v30.48,46.99 23.13,46.99 H/LC1.2 | v39.37,57.15 34.29,57.15 30.48,53.34 v30.48,52.07
  Bottom 0.152: X22.2 82.55,57.15 v39.37,57.15 | v30.48,52.07 v30.48,46.99
-HP/LP_AMP3  (via drill 0.35)
  Top 0.152: 23.13,42.91 H/LC2.2 24.4,42.91 25.4,41.91 v31.75,41.91 IC4.6 36.83,41.91
  Bottom 0.152: v31.75,41.91 31.75,60.96 33.02,62.23 X24.2
-HP/LP_AMP4  (via drill 0.35)
  Top 0.152: HLR7.2 64.77,44.23 HLR6.1 HLR5.2 63.72,46.99 v62.23,46.99 | IC4.13 v53.34,46.99
  Bottom 0.152: v53.34,46.99 v62.23,46.99
-HP/LP_AMP5  (via drill 0.35)
  Top 0.152: v40.64,29.21 40.64,40.64 41.91,41.91 IC4.9 52.34,41.91 H/LC3.2
  Bottom 0.152: X30.2 36.83,25.4 v40.64,29.21
-HP/LP_AMP6  (via drill 0.35)
  Top 0.152: 111.49,53.34 H/LC4.2 | v74.93,53.34 73.66,53.34 72.39,52.07 v72.39,40.64 | v55.88,25.4 v55.88,38.1 | H/LC4.2 129.1,53.61 IC5.2 | H/LC4.2 105.68,53.61 v105.41,53.34
  Bottom 0.152: v55.88,38.1 57.15,39.37 71.12,39.37 v72.39,40.64 | X32.2 49.53,15.24 55.88,21.59 v55.88,25.4 | v105.41,53.34 v74.93,53.34
-HP/LP_AMP7
  Top 0.152: HLR9.2 132.08,40.86 132.08,46.99 130.81,48.26 129.54,48.26 | 129.54,48.26 IC5.6 | 129.54,48.26 129.32,48.04 HLR11.2 109,48.26 HLR10.1
-HP/LP_AMP8  (via drill 0.35)
  Top 0.152: 151.13,53.34 H/LC5.2 v142.24,53.61 135.06,53.61 IC5.13 | v142.24,19.05 v142.24,43.18
  Bottom 0.152: X26.2 140.97,17.78 v142.24,19.05 | v142.24,43.18 v142.24,53.61
-HP/LP_AMP9
  Top 0.152: IC5.9 148.59,48.26 149.86,49.53 151.13,49.53 H/LC6.2 151.13,49.03 152.16,48.01 152.16,46.52 151.13,45.49 151.13,10.16 148.59,7.62 X28.2
BP2_BUFFER_IN  (via drill 0.35)
  Top 0.152: v118.11,196.85 119.38,195.58 v119.38,163.83 B2C1.1 | IC1.12 v91.44,196.85
  Bottom 0.152: X7.1 118.11,162.56 v119.38,163.83 | v91.44,196.85 v118.11,196.85
BP2_BUFFER_OUT
  Top 0.152: X4.2 111.76,196.85 110.49,198.12 IC1.13 IC1.14
BP2_IN  (via drill 0.35, 1 pad 1.3)
  Top 0.152: U1.1 59.69,85.5 59.69,74.93 60.96,73.66 63.5,73.66 72.39,82.55 72.39,111.76 74.93,114.3 93.98,114.3 95.25,115.57 v111.76,115.57 | v121.92,154.94 119.38,157.48 B2C1.2
  Bottom 0.152: v111.76,115.57 114.3,115.57 133.35,134.62 v133.35,149.86 133.35,153.67 132.08,154.94 v121.92,154.94
BP2_OUT  (via drill 0.35, 1 pad 1.3)
  Top 0.152: B2C2.1 v124.46,167.64 v139.7,167.64 v153.67,167.64 | U2.1 153.67,86.77 v153.67,81.28
  Bottom 0.152: v124.46,167.64 X8.1 | v153.67,81.28 154.94,80.01 157.48,80.01 158.75,81.28 158.75,162.56 v153.67,167.64
BP2_POT1_IN
  Top 0.152: A.17 107.31,165.74 107.95,165.1 X7.2
BP2_POT1_OUT
  Top 0.152: A.16 106.05,164.47 110.49,160.02 X3.1
BP2_POT2_IN
  Top 0.152: A.21 103.5,170.81 105.41,172.72 X4.1
BP2_POT2_OUT
  Top 0.152: A.20 106.05,169.54 106.68,170.18 X8.2
BP6_AMP1_OUT  (via drill 0.35)
  Top 0.152: B6R3.1 72.61,127 | 83.65,124.63 IC2.1 76.2,124.46 73.88,126.78 B6R3.1 | B6R3.1 v72.39,132.08 | X9.1 52.07,147.32 v71.12,147.32
  Bottom 0.152: v72.39,132.08 72.39,146.05 v71.12,147.32
BP6_AMP2_OUT  (via drill 0.35)
  Top 0.152: v40.64,138.43 39.64,138.43 B6C1.1 v38.1,116.84 | v52.07,115.57 56.93,115.57 B6R4.1 82.6,115.79 IC2.7
  Bottom 0.152: v40.64,138.43 X11.1 | v38.1,116.84 39.37,115.57 v52.07,115.57
BP6_AMP3_OUT  (via drill 0.35)
  Top 0.152: B6C2.1 102.6,124.46 | B6R1.1 89.07,130.42 IC2.14 89.34,124.19 B6C2.1 | B6C2.1 v102.87,133.35
  Bottom 0.152: v102.87,133.35 102.87,151.13 104.14,152.4 X17.1
BP6_AMP4_OUT
  Top 0.152: X13.1 117.89,128.49 B6R7.1 | B6R7.1 118.11,124.24 | B6R7.1 128.05,114.3 IC3.1 128.1,121.75 129.54,123.19 153.67,123.19 155.11,121.75 155.11,115.57 155.11,115.47 | 155.02,115.22 155.11,115.31 155.11,115.47 | B6C6.1 155.11,115.47
BP6_AMP5_OUT  (via drill 0.35)
  Top 0.152: 111.49,104.14 B6C4.1 | v101.6,104.14 103.92,104.14 B6R8.1 111.71,104.36 B6C4.1 | B6C4.1 112.03,104.41 114.3,106.68 IC3.7
  Bottom 0.152: X15.1 99.06,106.68 v101.6,104.14
BP6_AMP6_OUT
  Top 0.152: 146.32,115.57 146.19,115.44 B6C5.1 144.51,115.3 143.51,114.3 IC3.14 133.52,120.26 B6R5.1
BP6_BUFFER  (via drill 0.35)
  Top 0.152: 127,138.16 B6C3.1 127.27,145.78 v127,146.05 | IC2.10 113.91,119.38 v115.18,120.65
  Bottom 0.152: v127,146.05 125.73,147.32 X18.2 115.18,143.9 v115.18,120.65
BP6_BUFFER_OUT  (via drill 0.35)
  Top 0.152: IC2.9 IC2.8 v101.6,116.84 | v107.95,113.03 B6R6.2
  Bottom 0.152: v101.6,116.84 105.41,113.03 v107.95,113.03
BP6_IN  (via drill 0.35, 1 pad 1.3)
  Top 0.152: B6R2.2 57.37,130.81 v46.99,130.81 | U1.5 56.52,92.08 v55.88,91.44 | v26.67,88.9 24.13,91.44 v24.13,124.46 24.13,125.73 v29.21,130.81
  Bottom 0.152: v46.99,130.81 v29.21,130.81 | v55.88,91.44 53.34,88.9 v26.67,88.9
BP6_OUT  (via drill 0.35, 1 pad 1.3)
  Top 0.152: X19.2 v80.01,101.6 | 154,92.08 U2.5 154.08,91.44 156.21,91.44 158.44,93.67 158.44,94.28 154.94,97.79 | v139.7,97.79 154.94,97.79 | B6C6.2 154.94,97.79
  Bottom 0.152: v139.7,97.79 v121.92,97.79 87.63,97.79 85.09,100.33 81.28,100.33 v80.01,101.6
BP6_POT1_IN
  Top 0.152: X9.2 64.77,151.13 67.31,148.59 73.66,148.59 74.3,147.96 B.3
BP6_POT1_OUT
  Top 0.152: 78.74,146.69 B.4 74.3,146.69 73.66,146.05 X10.1
BP6_POT2_IN
  Top 0.152: B.9 74.3,140.34 73.66,140.97 X11.2
BP6_POT2_OUT
  Top 0.152: B.10 75.56,139.06 74.93,138.43 59.69,138.43 57.15,135.89 X12.1
BP6_POT3_IN
  Top 0.152: X17.2 108.58,146.69 B.21
BP6_POT3_OUT
  Top 0.152: B.20 111.12,145.41 X18.1
BP6_POT4_IN
  Top 0.152: B.16 104.78,140.34 107.95,137.16 X13.2
BP6_POT4_OUT
  Top 0.152: B.17 107.31,141.6 107.95,142.24 X14.1
BP6_POT5_IN
  Top 0.152: X15.2 90.17,95.25 88.27,93.34 C.3
BP6_POT5_OUT
  Top 0.152: X16.1 87.63,90.17 87.19,89.72 C.4
BP6_POT6_IN
  Top 0.152: X19.1 82.55,102.87 80.64,100.97 C.9
BP6_POT6_OUT
  Top 0.152: X20.2 78.74,105.41 78.74,90.36 C.10
BUFFER1_OUT  (via drill 0.35)
  Top 0.152: IC1.6 IC1.7 72.22,182.88 v46.99,182.88 | v60.96,77.47 60.96,88.9 60.33,89.53 U1.3
  Bottom 0.152: v46.99,182.88 24.13,182.88 6.35,165.1 6.35,83.82 13.97,76.2 59.69,76.2 v60.96,77.47
BUFFER2_IN  (via drill 0.35)
  Top 0.152: IC1.10 v91.44,194.31 | U2.3 153.67,89.53 154.31,89.53 156.84,89.53 158.75,91.44 158.75,184.15 156.21,186.69 v149.86,193.04
  Bottom 0.152: v149.86,193.04 148.59,194.31 v91.44,194.31
GND  (via drill 0.35)
  Top 0.152: U3.8 87.12,35.56 | 102.87,24.35 PD3.2 | X20.1 74.93,102.65 PC2.1 | U2.8 155.57,95.89 v157.48,93.98
  Bottom 0.152: v157.48,93.98 v157.48,87.63
  pour Top: 0,205.74 160.02,205.74 160.02,0 0,0
HP1_IN  (via drill 0.35, 1 pad 1.3)
  Top 0.152: 31.75,88.9 v33.02,87.63 30.48,90.17 v30.48,163.83 30.48,172.45 HPC.1 | v45.72,87.63 52.93,87.63 U1.15
  Bottom 0.152: v33.02,87.63 v45.72,87.63
HP1_OUT  (via drill 0.35, 1 pad 1.3)
  Top 0.152: v39.37,88.29 35.56,92.1 v35.56,163.83 35.56,172.45 HPC.2 v39.37,173.99 | v139.7,88.9 147.75,88.9 148.06,88.59 148.49,88.59 U2.15
  Bottom 0.152: 39.41,88.26 v39.37,88.29 58.42,88.29 139.09,88.29 v139.7,88.9 | v39.37,173.99 X2.1
HP1_POT_IN
  Top 0.152: A.3 61.59,172.09 60.96,171.45 X2.2
HP1_POT_OUT
  Top 0.152: A.4 77.47,170.81 76.83,170.81 52.7,170.81 X1.1
HP/LP_AMP2_OUT  (via drill 0.35)
  Top 0.152: v39.37,55.88 37.93,54.44 IC4.1 24.13,48.26 23.13,49.26 H/LC1.1 | v81.28,55.88 82.55,57.15 X23.1 v82.55,67.31 | v132.08,68.58 135.89,72.39 HLR4.1
  Bottom 0.152: v39.37,55.88 v81.28,55.88 | v82.55,67.31 83.82,68.58 v132.08,68.58
HP/LP_AMP5_OUT  (via drill 0.35)
  Top 0.152: HLR8.1 58.42,43.18 56.15,40.91 H/LC3.1 53.07,40.64 IC4.8 43.18,40.47 v43.18,27.94
  Bottom 0.152: X31.1 35.56,20.32 v43.18,27.94
HP/LP_AMP8_OUT  (via drill 0.35)
  Top 0.152: HLR12.1 150.91,55.83 H/LC5.1 | v156.21,16.51 156.21,50.53 H/LC5.1 | H/LC5.1 135.79,55.61 IC5.14
  Bottom 0.152: X27.1 152.4,12.7 v156.21,16.51
HP/LP_HP_OUT1  (via drill 0.35)
  Top 0.152: HLR3.1 101.49,62.12 | 101.49,62.12 101.38,62.23 | v91.44,57.15 92.71,58.42 X21.1 101.49,62.23 | v83.82,55.88 83.82,41.91 83.19,41.27 U3.12 | IC3.8 133.52,72.56 v132.08,71.12 | v101.6,69.85 101.49,69.74 101.49,62.23 | 101.49,62.23 101.49,62.12
  Bottom 0.152: v91.44,57.15 85.09,57.15 v83.82,55.88 | v132.08,71.12 102.87,71.12 v101.6,69.85
HP/LP_HP_OUT2  (via drill 0.35)
  Top 0.152: 64.99,31.75 HLR7.1 64.77,31.75 63.5,30.48 v58.42,30.48 | v78.74,31.75 79.38,32.38 U3.2 | IC4.14 v45.72,48.26 | v27.94,38.1 25.4,38.1 24.13,36.83 X29.1
  Bottom 0.152: X29.1 v58.42,30.48 76.2,30.48 77.47,30.48 v78.74,31.75 | v45.72,48.26 46.99,46.99 46.99,40.64 44.45,38.1 v27.94,38.1
HP/LP_HP_OUT3
  Top 0.152: X25.1 128.27,26.67 129.54,27.94 129.54,46.82 129.45,46.9 | 129.45,46.9 IC5.7 | 83.19,36.29 U3.5 83.19,32.38 85.09,30.48 107.95,30.48 109.22,31.75 HLR11.1 128.49,45.94 129.45,46.9
HP/LP_IN1  (via drill 0.35, 1 pad 1.3)
  Top 0.152: U1.2 57.56,87.63 57.15,87.63 55.88,86.36 v55.88,82.55 | HLR1.2 111.76,59.91 v111.76,80.01
  Bottom 0.152: v55.88,82.55 57.15,81.28 v64.77,81.28 110.49,81.28 v111.76,80.01
HP/LP_IN2
  Top 0.152: U3.14 80.64,39.91 79.77,39.04 79.68,39.04 78.74,38.1 72.39,38.1 67.09,43.4 HLR6.2
HP/LP_IN3  (via drill 0.35)
  Top 0.152: HLR10.2 v85.09,48.26 | U3.15 79.38,46.35 v81.28,48.26
  Bottom 0.152: v85.09,48.26 v81.28,48.26
HP/LP_LP_OUT1  (via drill 0.35)
  Top 0.152: U3.13 81.92,51.44 v82.55,52.07 | v41.91,52.07 40.64,50.8 40.64,41.91 39.37,40.64 IC4.7 23.13,40.64 H/LC2.1 | HLR2.1 101.38,52.07 v95.25,52.07
  Bottom 0.152: v41.91,52.07 v82.55,52.07 v95.25,52.07
HP/LP_LP_OUT2  (via drill 0.35)
  Top 0.152: H/LC4.1 111.49,55.61 | H/LC4.1 128.37,55.61 IC5.1 | HLR5.1 70.9,44.45 v71.12,44.45 | v73.66,36.83 74.93,35.56 77.98,35.56 | 77.98,35.56 U3.1 | H/LC4.1 111.49,55.88 v107.95,55.88 | v104.14,27.94 80.01,27.94 77.98,29.97 77.98,35.56
  Bottom 0.152: v71.12,44.45 73.66,41.91 v73.66,36.83 | v107.95,55.88 106.68,54.61 106.68,29.21 105.41,27.94 v104.14,27.94
HP/LP_LP_OUT3  (via drill 0.35)
  Top 0.152: v133.35,29.21 134.62,30.48 134.62,40.42 HLR9.1 134.79,41.03 IC5.8 150.86,46.99 H/LC6.1 | U3.3 80.64,29.84 81.28,29.21 v118.11,29.21
  Bottom 0.152: v118.11,29.21 v133.35,29.21
HP/LP_OUT  (via drill 0.35, 1 pad 1.3)
  Top 0.152: U2.2 154.08,87.63 154.94,87.63 157.48,85.09 v157.48,71.12 v157.48,31.75 | U3.4 82.55,35.05 82.55,31.75 84.12,30.18 108.08,30.18 108.38,30.48 v118.11,30.48
  Bottom 0.152: v157.48,31.75 156.21,30.48 v118.11,30.48
HP/LP_POT1_IN
  Top 0.152: C.21 87,69.22 90.17,66.04 X21.2
HP/LP_POT1_OUT
  Top 0.152: X22.1 85.09,79.82 C.20
HP/LP_POT2_IN
  Top 0.152: X23.2 81.92,64.14 C.17
HP/LP_POT2_OUT
  Top 0.152: X24.1 80.64,65.41 C.16
HP/LP_POT3_IN
  Top 0.152: X29.2 33.02,27.94 41.27,19.68 D.4
HP/LP_POT3_OUT
  Top 0.152: X30.1 35.56,22.86 40.01,18.41 D.5
HP/LP_POT4_IN
  Top 0.152: D.9 77.47,13.34 76.83,13.34 29.84,13.34 25.4,17.78 X31.2
  Bottom 0.152: X31.2 25.4,17.78
HP/LP_POT4_OUT
  Top 0.152: 77.47,12.06 D.10 64.14,12.06 63.5,12.7 X32.1
HP/LP_POT5_IN
  Top 0.152: D.21 125.09,19.68 X25.2
HP/LP_POT5_OUT
  Top 0.152: D.20 126.36,18.41 X26.1
HP/LP_POT6_IN
  Top 0.152: D.17 121.28,14.61 121.92,15.24 X27.2
HP/LP_POT6_OUT
  Top 0.152: X28.1 127,10.16 123.83,13.34 D.16
HP/LP_TOGGLE  (via drill 0.35)
  Top 0.152: v8.89,92.71 8.67,92.49 S0-3R.1 17.78,36.83 v19.05,35.56 | U3.10 U3.9 91.57,40.51 v92.71,39.37 | U3.10 U3.11 | 85.72,40.01 U3.10
  Bottom 0.152: v8.89,92.71 10.16,93.98 SV1.8 | v92.71,39.37 92.71,38.1 91.44,36.83 74.93,36.83 73.66,35.56 v19.05,35.56
LP1_IN  (via drill 1 pad 1.3)
  Top 0.152: X5.2 48.26,163.83 45.72,161.29 v45.72,123.19 45.72,96.52 44.45,95.25 44.45,91.44 45.72,90.17 49.53,90.17 50.49,91.14 50.93,91.14 51.87,92.08 52.7,92.08 53.34,92.08 U1.12
LP1_OUT  (via drill 0.35, 1 pad 1.3)
  Top 0.152: X6.1 51.07,155.94 LPC.2 63.77,156.21 v78.74,156.21 | v142.24,92.71 142.88,92.08 U2.12
  Bottom 0.152: v78.74,156.21 135.89,156.21 140.97,151.13 v140.97,143.51 140.97,93.98 v142.24,92.71
LP1_POT_IN
  Top 0.152: X5.1 54.61,165.1 69.85,165.1 70.48,164.47 A.9
LP1_POT_OUT
  Top 0.152: X6.2 55.88,163.83 69.85,163.83 70.48,163.19 A.10
N$1
  Top 0.152: A.2 74.3,173.35 73.66,173.99 PA0.2
N$2
  Top 0.152: PA2.2 69.85,162.56 70.48,161.93 A.11
N$3
  Top 0.152: A.14 92.08,161.93 92.71,161.29 PA1.1
N$4
  Top 0.152: PA3.1 88.9,175.07 A.24
N$5
  Top 0.152: 79.18,149.42 B.2 71.54,149.22 PB0.2
N$6
  Top 0.152: 78.74,137.79 B.11 75.56,137.79 74.93,137.16 PB2.2
N$7
  Top 0.152: PB1.1 96.1,137.79 B.14
N$8
  Top 0.152: PB3.1 96.1,150.5 B.24
N$9
  Top 0.152: C1.2 55.88,192.82 NR3.2 55.66,197.77 C2.1
N$10
  Top 0.152: PC0.2 91.44,96.3 91.44,93.98 89.53,92.08 C.2
N$11
  Top 0.152: PC2.2 77.47,90.36 C.11
N$12
  Top 0.152: PC1.1 78.11,75.35 C.14
N$13
  Top 0.152: PC3.1 91.25,80.01 C.24
N$14
  Top 0.152: PD0.2 77.05,22.23 D.2
N$15
  Top 0.152: D.11 62.87,10.79 62.23,11.43 PD2.2
N$16
  Top 0.152: D.14 99.48,10.79 PD1.1
N$17
  Top 0.152: D.24 94.61,23.5 95.25,24.13 PD3.1
N$18  (via drill 3.56 pad 1.3)
  other vias: 3.43,202.06
N$19
  Top 0.152: NR1.1 NR2.2 44.65,194.53 C3.1
N$20  (via drill 3.56 pad 1.3)
  other vias: 156.72,202.18
N$21  (via drill 3.56 pad 1.3)
  other vias: 3.3,3.3
N$22  (via drill 3.56 pad 1.3)
  other vias: 156.72,3.3
NOTCH_IN  (via drill 1 pad 1.3)
  Top 0.152: 41.91,181.61 v41.91,180.34 | v41.91,180.34 41.91,91.44 43.48,89.86 53.24,89.86 U1.14 | v41.91,180.34 NR1.2 55.53,185.64 C1.1
NOTCH_OUT  (via drill 0.35, 1 pad 1.3)
  Top 0.152: v143.51,91.44 145.41,89.53 U2.14 | v139.7,181.61 119.38,201.93 v99.06,201.93 98.84,201.71 NR4.1 63.28,201.93 59.69,201.93 58.55,200.79 C2.2 46.07,200.79 NR2.1
  Bottom 0.152: v139.7,181.61 143.51,177.8 v143.51,91.44
PASS  (via drill 0.35, 1 pad 1.3)
  Top 0.152: v67.31,91.44 66.67,90.81 59.71,90.81 59.23,91.29 57.16,91.29 56.67,90.81 U1.13 | v146.05,90.17 148.18,90.17 U2.13
  Bottom 0.152: v67.31,91.44 v124.46,91.44 142.24,91.44 143.51,90.17 v146.05,90.17
SCL  (via drill 0.35)
  Top 0.152: 97.48,102.87 v97.18,102.87 97.79,102.26 97.79,85.09 95.25,82.55 91.44,82.55 89.53,80.64 C.23 | SV1.12 13.75,98.84 v11.43,98.84 SCLR.2 3.81,100.11 3.81,152.4 6.35,154.94 | 6.35,154.94 v26.67,154.94 | B.23 87,149.22 v81.28,154.94 73.66,154.94 72.39,153.67 v71.12,153.67 | 6.35,154.94 6.35,171.45 12.7,177.8 v39.37,177.8 | v76.2,177.8 83.82,177.8 86.36,175.26 86.36,173.99 87,173.35 A.23 | D.23 95.89,22.23 v96.52,21.59 | v11.43,74.93 v11.43,95.25
  Bottom 0.152: SV1.12 17.78,102.87 v97.18,102.87 | v39.37,177.8 v76.2,177.8 | v96.52,21.59 97.79,20.32 97.79,3.81 96.52,2.54 16.51,2.54 11.43,7.62 v11.43,74.93 | v11.43,95.25 v11.43,98.84 | v26.67,154.94 27.94,153.67 v71.12,153.67
SDA  (via drill 0.35)
  Top 0.152: C.13 75.12,78.74 v74.93,78.74 | 97.79,74.93 v98.09,74.93 100.63,77.47 106.68,77.47 107.95,78.74 107.95,100.33 105.41,102.87 100.33,102.87 99.06,104.14 99.06,113.03 v97.79,114.3 | SDAR.2 7.4,86.58 v7.62,86.36 | v69.85,157.48 86.36,157.48 88.46,159.58 A.13 | D.13 90.81,9.53 v91.44,8.89 | v13.97,71.12 SV1.2 | B.13 94.61,136.53 v97.79,133.35
  Bottom 0.152: v74.93,78.74 71.12,78.74 | 71.12,78.74 21.59,78.74 SV1.2 v7.62,86.36 7.62,153.67 11.43,157.48 v69.85,157.48 | 71.12,78.74 74.93,74.93 v98.09,74.93 | v97.79,114.3 v97.79,133.35 | v91.44,8.89 91.44,5.08 90.17,3.81 16.51,3.81 13.97,6.35 v13.97,71.12
SYSTEM_0  (via drill 0.35)
  Top 0.152: v26.67,91.44 27.94,90.17 RS0.1 | v45.72,91.44 50.8,91.44 52.7,93.34 U1.11 | U2.11 140.34,93.34 v139.7,92.71
  Bottom 0.152: SV1.5 v26.67,91.44 v45.72,91.44 46.99,92.71 v139.7,92.71
SYSTEM_1  (via drill 0.35)
  Top 0.152: v33.02,93.98 34.29,92.71 RS1.1 | v45.72,93.98 52.93,93.98 U1.10 | v139.7,95.25 148.18,95.25 U2.10
  Bottom 0.152: SV1.7 v33.02,93.98 v45.72,93.98 54.61,93.98 55.88,95.25 v139.7,95.25
SYSTEM_2  (via drill 0.35)
  Top 0.152: v39.37,96.52 40.64,95.25 RS2.1 | U2.9 148.18,96.52 v139.7,96.52 | v67.31,96.52 54.61,96.52 53.98,95.89 U1.9 51.66,97.79 v48.26,97.79
  Bottom 0.152: SV1.9 v39.37,96.52 40.64,97.79 v48.26,97.79 | v67.31,96.52 v139.7,96.52
SYSTEM_E  (via drill 0.35)
  Top 0.152: v20.32,88.9 21.59,87.63 RE.1 | U2.6 152.81,93.98 v139.7,93.98 | 57.78,93.34 U1.6 66.67,93.34 v67.31,93.98 68.58,93.98 69.85,92.71 69.85,87.63 v67.31,85.09 | U3.6 84.45,37.47 83.82,38.1 82.88,39.04 82.79,39.04 82.65,39.17 82.65,41.85 83.52,42.72 83.52,52.07 76.2,59.38 76.2,69.85 73.66,72.39 v73.66,93.98
  Bottom 0.152: SV1.3 v20.32,88.9 21.59,88.9 25.4,85.09 v67.31,85.09 | v67.31,93.98 v73.66,93.98 v139.7,93.98
SYSTEM_IN
  Top 0.152: X34.1 IC1.5
SYSTEM_OUT  (via drill 0.35)
  Top 0.152: IC1.9 IC1.8 v91.44,191.77
  Bottom 0.152: v91.44,191.77 X33.1

### Text on the board
tNames: Taylor's CyDAQ Test Board. Rev 2, Spring 2019 | Notch Output | Filter S0 S1 S2 S3 Hp/Lp E | Pass 0 0 0 0 x 0 | Notch 1 0 0 0 x 0 | HP1 0 1 0 0 x 0 | LP1 1 1 0 0 x 0 | BP2 0 0 1 0 x 0 | Notch Input | BP6 1 0 1 0 x 0 | HP6 0 1 1 0 0 0 | LP6 0 1 1 0 1 0 | Potentiometer addresses: | A: 0101_0000 | HP_IN | HP_OUT | BP2_OUT | B: 0101_0001 | C: 0101_0010 | D: 0101_0011 | Potentiometers by filter type: | HP1: A3 | BP2_IN | LP1: A0 | BP2: Lp A2, Hp A1 | LP_OUT | BP6: Lp B0 B2 B3, Hp B1 C0 C3 | Hp/Lp 6: C1-2, D0-3 | BP6_IN | LP_IN | SCL | +5v | BP6_OUT | 3v3 | S2 | H/L_T | S1 | GND | S0 | PASS | GND | E | SDA | -5v | HP/LP_IN | HP/LP_OUT